# Altium project power_board.PrjPcb (part 1 of 2)
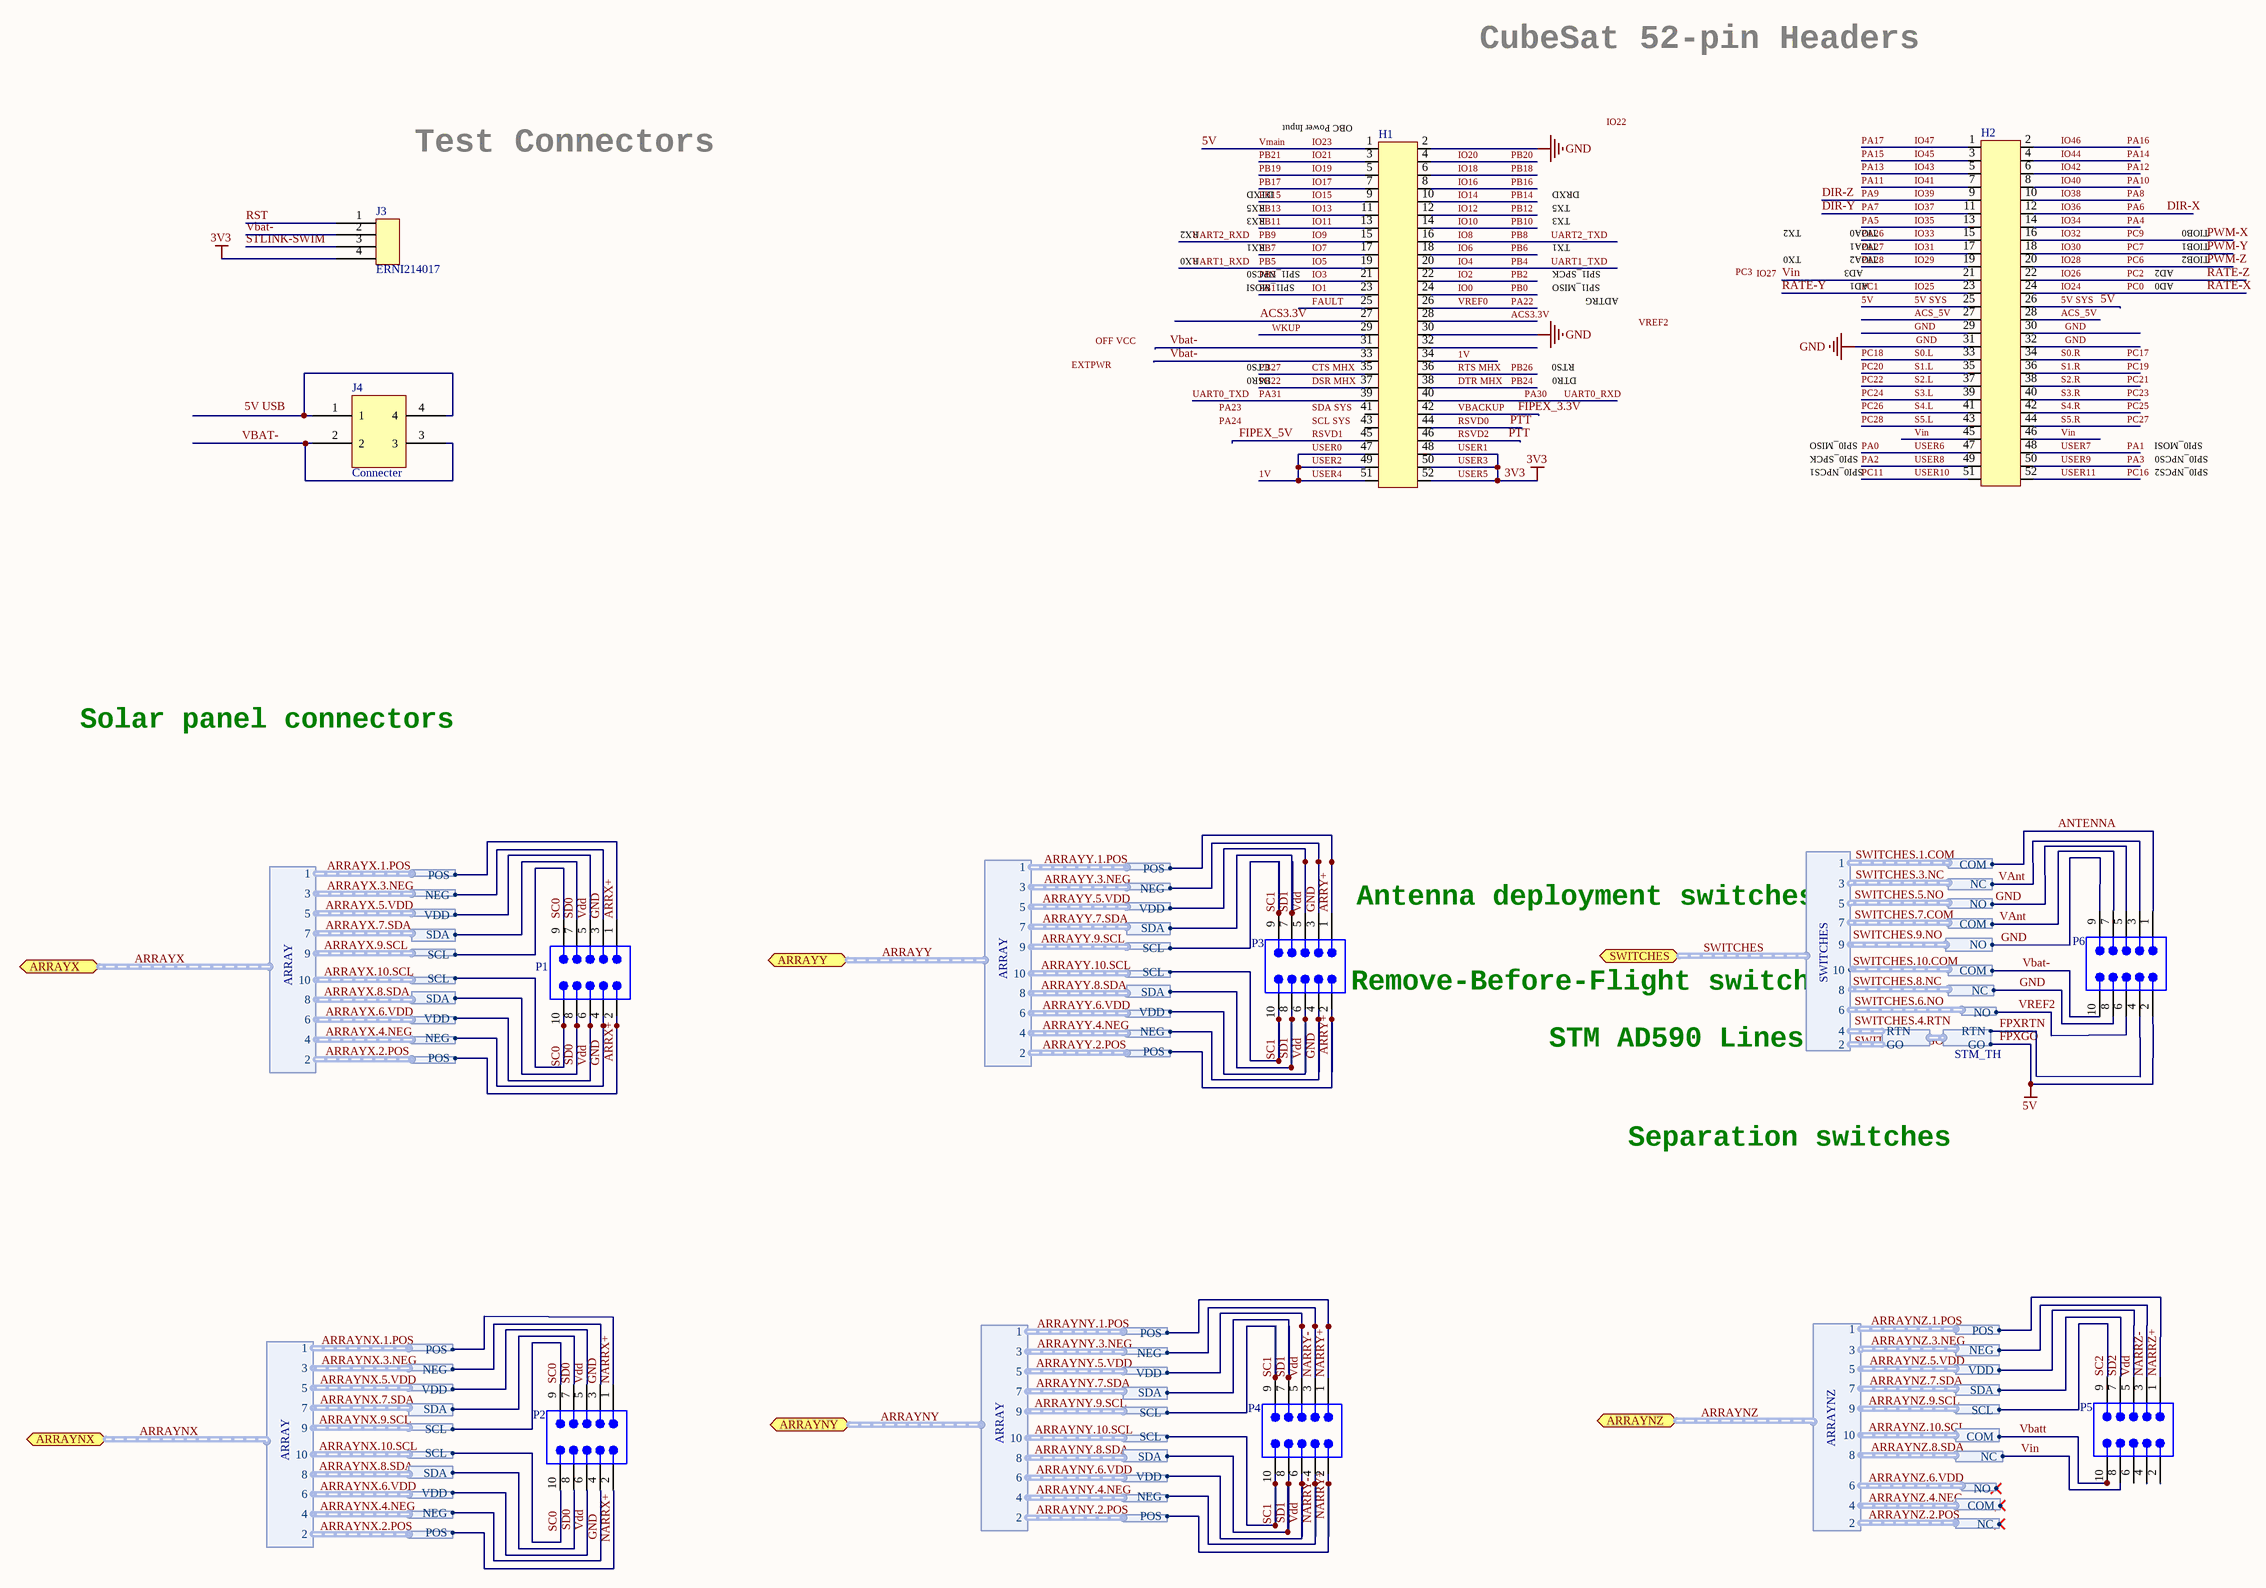
[diagram p0: power_board_2.SchDoc.SchDoc]
5 sheets, 240 parts. Net scope: global (net labels, ports and power ports of the same name join across sheets).
Board file: PCB1_done2.PcbDoc
Sheets:
  power_board_2.SchDoc.SchDoc
  power_board_uC.SchDoc
  MPPT-BCR.SchDoc
  BCR.SchDoc
  MPPT_Measurements.SchDoc

## Sheet power_board_2.SchDoc.SchDoc
size C

### Parts
H1  (no value)  [SAMTEC_ESQ_126_39_G_D]
H2  (no value)  [SAMTEC_ESQ_126_39_G_D]
J3  ERNI214017  [ERNI2014017]
J4  Connecter  [Connecter]
P1  T2M-105-01-L-D-RA  [SMTC-T2M-105-01-X-D-RA]  (value not drawn)
P2  T2M-105-01-L-D-RA  [SMTC-T2M-105-01-X-D-RA]  (value not drawn)
P3  T2M-105-01-L-D-RA  [SMTC-T2M-105-01-X-D-RA]  (value not drawn)
P4  T2M-105-01-L-D-RA  [SMTC-T2M-105-01-X-D-RA]  (value not drawn)
P5  T2M-105-01-L-D-RA  [SMTC-T2M-105-01-X-D-RA]  (value not drawn)
P6  T2M-105-01-L-D-RA  [SMTC-T2M-105-01-X-D-RA]  (value not drawn)

### Ports
ARRAYNX (harness ARRAY), ARRAYNY (harness ARRAY), ARRAYNZ (harness ARRAYNZ), ARRAYX (harness ARRAY), ARRAYY (harness ARRAY), SWITCHES (harness SWITCHES)

### Harnesses
ARRAY: 1, 10, 2, 3, 4, 5, 6, 7, 8, 9
ARRAY+: POS
ARRAY-: NEG
VDD: VDD
SDA: SDA
SCL: SCL
SEPCOM: COM
SEPNC: NC
COM: COM
NC: NC
NO: NO
SWITCHES: 10, 8, 6, 4, 2, 9, 7, 5, 3, 1
STM_TH: RTN, GO
ARRAYNZ: 10, 8, 6, 4, 2, 9, 7, 5, 3, 1

### Nets
3V3: H1.48 H1.50 H1.52 J3.4(RST)  [also labelled USER1, USER3, USER5]
5V: H1.1 H2.25 H2.26 P5.10 P6.2 ; harness SEPCOM.COM, harness STM_TH.GO  [also labelled 5V SYS, FPXGO, IO23, Vbatt, Vmain]
ACS_5V: H2.27 H2.28
ANTENNA: P6.1 ; harness COM.COM
FIPEX_3.3V: H1.42  [also labelled VBACKUP]
FIPEX_5V: H1.45  [also labelled RSVD1]
GND: H1.2 H1.30 H2.29 H2.30 H2.31 H2.32 P1.3 P1.4 P2.3 P2.4 P3.3 P3.4 P6.5 P6.8 P6.9 ; harness ARRAY-.NEG, harness NO.NO, harness SEPNC.NC  [project net ARRAYNX.3.NEG.NEG]
PTT: H1.44 H1.46  [also labelled RSVD0, RSVD2]
1V: H1.34 H1.47 H1.49 H1.51  [also labelled USER0, USER2, USER4]
ACS3.3V: H1.27 H1.28
ARRX+: P1.1 P1.2 ; harness ARRAY+.POS  [project net ARRAYX.1.POS.POS]
ARRY+: P3.1 P3.2 ; harness ARRAY+.POS  [project net ARRAYY.1.POS.POS]
CTS MHX: H1.35  [also labelled PB27]
DIR-X: H2.12  [also labelled IO36, PA6]
DIR-Y: H2.11  [also labelled IO37, PA7]
DIR-Z: H2.9  [also labelled IO39, PA9]
DSR MHX: H1.37  [also labelled PB22]
DTR MHX: H1.38  [also labelled PB24]
FAULT: H1.25
FPXRTN: P6.4 ; harness STM_TH.RTN
IO0: H1.24  [also labelled PB0]
IO1: H1.23  [also labelled PB1]
IO2: H1.22  [also labelled PB2]
IO3: H1.21  [also labelled PB3]
IO4: H1.20  [also labelled PB4, UART1_TXD]
IO5: H1.19  [also labelled PB5, UART1_RXD]
IO6: H1.18  [also labelled PB6]
IO7: H1.17  [also labelled PB7]
IO8: H1.16  [also labelled PB8, UART2_TXD]
IO9: H1.15  [also labelled PB9, UART2_RXD]
IO10: H1.14  [also labelled PB10]
IO11: H1.13  [also labelled PB11]
IO12: H1.12  [also labelled PB12]
IO13: H1.11  [also labelled PB13]
IO14: H1.10  [also labelled PB14]
IO15: H1.9  [also labelled PB15]
IO16: H1.8  [also labelled PB16]
IO17: H1.7  [also labelled PB17]
IO18: H1.6  [also labelled PB18]
IO19: H1.5  [also labelled PB19]
IO20: H1.4  [also labelled PB20]
IO21: H1.3  [also labelled PB21]
IO24: H2.24  [also labelled PC0, RATE-X]
IO25: H2.23  [also labelled PC1, RATE-Y]
IO26: H2.22  [also labelled PC2, RATE-Z]
IO28: H2.20  [also labelled PC6, PWM-Z]
IO29: H2.19  [also labelled PA28]
IO30: H2.18  [also labelled PC7, PWM-Y]
IO31: H2.17  [also labelled PA27]
IO32: H2.16  [also labelled PC9, PWM-X]
IO33: H2.15  [also labelled PA26]
IO34: H2.14  [also labelled PA4]
IO35: H2.13  [also labelled PA5]
IO38: H2.10  [also labelled PA8]
IO40: H2.8  [also labelled PA10]
IO41: H2.7  [also labelled PA11]
IO42: H2.6  [also labelled PA12]
IO43: H2.5  [also labelled PA13]
IO44: H2.4  [also labelled PA14]
IO45: H2.3  [also labelled PA15]
IO46: H2.2  [also labelled PA16]
IO47: H2.1  [also labelled PA17]
NARRX+: P2.1 P2.2 ; harness ARRAY+.POS  [project net ARRAYNX.1.POS.POS]
NARRY+: P4.1 P4.2 ; harness ARRAY+.POS  [project net ARRAYNY.1.POS.POS]
NARRY-: P4.3 P4.4 ; harness ARRAY-.NEG  [project net ARRAYNY.3.NEG.NEG]
NARRZ+: P5.1 ; harness ARRAY+.POS  [project net ARRAYNZ.1.POS.POS]
NARRZ-: P5.3 ; harness ARRAY-.NEG  [project net ARRAYNZ.3.NEG.NEG]
PA0: H2.47  [also labelled USER6]
PA1: H2.48  [also labelled USER7]
PA2: H2.49  [also labelled USER8]
PA3: H2.50  [also labelled USER9]
PA22: H1.26  [also labelled VREF0]
PA30: H1.40  [also labelled UART0_RXD]
PA31: H1.39  [also labelled UART0_TXD]
PB26: H1.36  [also labelled RTS MHX]
PC11: H2.51  [also labelled USER10]
PC16: H2.52  [also labelled USER11]
PC17: H2.34  [also labelled S0.R]
PC18: H2.33  [also labelled S0.L]
PC19: H2.36  [also labelled S1.R]
PC20: H2.35  [also labelled S1.L]
PC21: H2.38  [also labelled S2.R]
PC22: H2.37  [also labelled S2.L]
PC23: H2.40  [also labelled S3.R]
PC24: H2.39  [also labelled S3.L]
PC25: H2.42  [also labelled S4.R]
PC26: H2.41  [also labelled S4.L]
PC27: H2.44  [also labelled S5.R]
PC28: H2.43  [also labelled S5.L]
RST: J3.1(VCC)
SC0: P1.9 P1.10 P2.9 P2.10 ; harness SCL.SCL  [project net ARRAYNX.10.SCL.SCL]
SC1: P3.9 P3.10 P4.9 P4.10 ; harness SCL.SCL  [project net ARRAYNY.10.SCL.SCL]
SC2: P5.9 ; harness SCL.SCL  [project net ARRAYNZ.9.SCL.SCL]
SD0: P1.7 P1.8 P2.7 P2.8 ; harness SDA.SDA  [project net ARRAYNX.7.SDA.SDA]
SD1: P3.7 P3.8 P4.7 P4.8 ; harness SDA.SDA  [project net ARRAYNY.7.SDA.SDA]
SD2: P5.7 ; harness SDA.SDA  [project net ARRAYNZ.7.SDA.SDA]
STLINK-SWIM: J3.3(GND)
VAnt: P6.3 P6.7 ; harness NC.NC, harness COM.COM  [project net SWITCHES.3.NC.NC]
Vbat-: H1.31 H1.33 J3.2(DATA) J4.2 J4.3 P6.10 ; harness SEPCOM.COM  [project net SWITCHES.10.COM.COM]
Vdd: P1.5 P1.6 P2.5 P2.6 P3.5 P3.6 P4.5 P4.6 P5.5 ; harness VDD.VDD  [project net ARRAYNX.5.VDD.VDD]
Vin: H2.21 H2.45 H2.46 P5.8 ; harness SEPNC.NC  [project net ARRAYNZ.8.SDA.NC]
VREF2: P6.6 ; harness NO.NO
WKUP: H1.29
NetJ4_1: J4.1 J4.4

Not connected (* = marked no-connect by the designer): H1 32 41 43; P5 2 4 6

### Buses and harness runs
harness ARRAYNX = port ARRAYNX
harness ARRAYNY = port ARRAYNY
harness ARRAYNZ = port ARRAYNZ
harness ARRAYX = port ARRAYX
harness ARRAYY = port ARRAYY
harness SWITCHES = port SWITCHES

### Notes on the sheet
- CubeSat 52-pin Headers
- Test Connectors
- OBC Power Input
- RX2
- RX3
- RX5
- DTXD
- TX3
- TX5
- DRXD
- TX2
- TIOA0
- TIOB0
- RX0
- RX1
- SPI1_NPCS0
- SPI1_MOSI
- TX1
- SPI1_SPCK
- SPI1_MISO
- ADTRG
- TX0
- AD3
- AD1
- TIOA1
- TIOA2
- AD0
- AD2
- TIOB1
- TIOB2
- CTS0
- RTS0
- DSR0
- DTR0
- SPI0_MISO
- SPI0_SPCK
- SPI0_NPCS1
- SPI0_MOSI
- SPI0_NPCS0
- SPI0_NPCS2
- Solar panel connectors
- (near P3) Antenna deployment switches
- (near P3) Remove-Before-Flight switch
- STM AD590 Lines
- Separation switches
- Labels drawn without touching a wire or pin: 5V USB, EXTPWR, IO22, IO27, OFF VCC, PA23, PA24, PC3, SCL SYS, SDA SYS, SWITCHES.2.GO, SWITCHES.4.RTN, SWITCHES.6.NO, SWITCHES.9.NO, VREF2

### Library data of the parts
H1 H2 = SAMTEC_ESQ_126_39_G_D: 26X2 header
P1-P6 = CMP-1029-00150-1: High Reliability Cable Header, Through-hole, Right Angle, -55 to 125 degC, 2 mm Pitch, 10-Pin, Male, RoHS; Manufacturer: Samtec; Pitch: 2 mm; PackageVersion: V, 3/2009; ComponentLink3Description: Package Specification; ComponentLink2Description: Datasheet; Mounting Technology: Through-hole; DatasheetVersion: F-214; PartNumber: T2M-105-01-L-D-RA; PackageReference: T2M-105-01-X-D-RA; ComponentLink2URL: http://d2a072wq521u33.cloudfront.net/catalog_english//t2m.pdf; ComponentLink3URL: http://www.samtec.com/documents/webfiles/cpdf/T2M-1XX-XX-X-D-XX-XX-MKT.pdf; Temperature Range: -55 to 125 degC; ComponentLink1URL: http://www.samtec.com; RoHS: True; PackageDescription: 2mm Shrouded Terminal Strip; ComponentLink1Description: Manufacturer URL; Orientation: Right Angle; Supplier 1: Newark; Supplier Part Number 1: 79X2144
J3 = ERNI214017: Supplier 1: Mouser; Supplier Part Number 1: 305-214017
J4 = Connecter: Supplier 1: Digi-Key; Supplier Part Number 1: SAM1006-02-ND

## Sheet power_board_uC.SchDoc
size A4
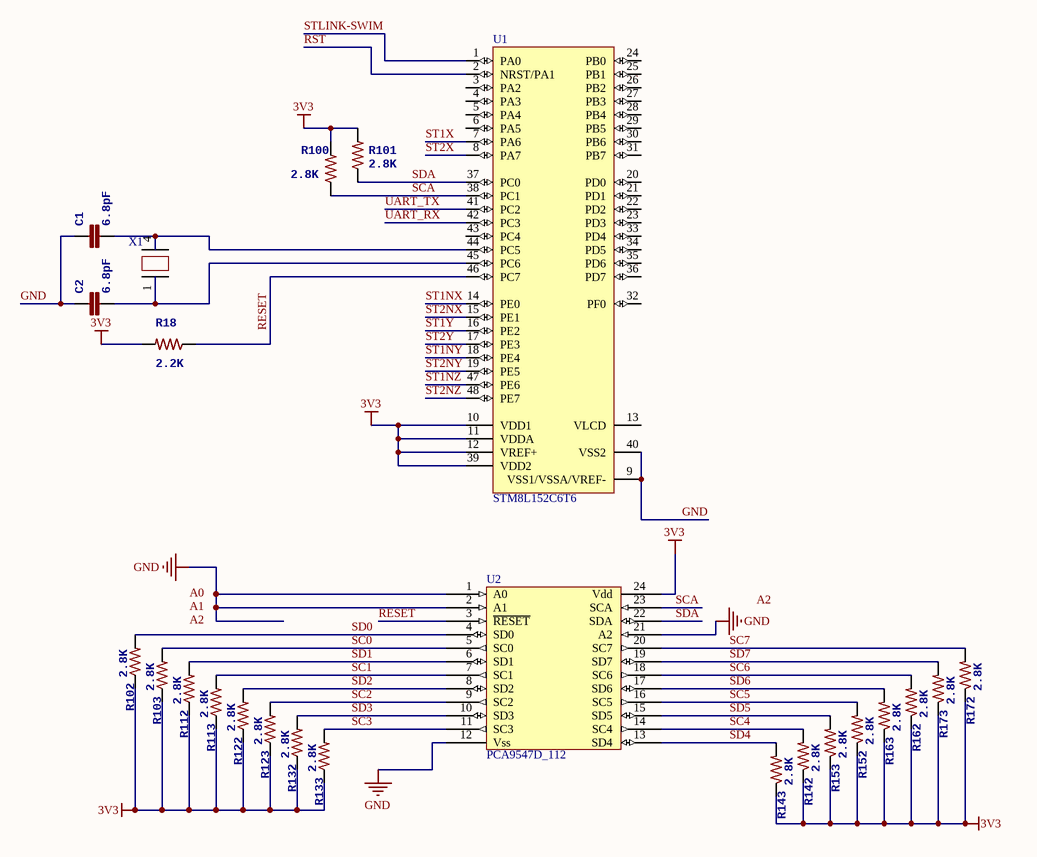
[diagram p1: power_board_uC.SchDoc]

### Parts
C1  6.8pF  [0402-CAP]
C2  6.8pF  [0402-CAP]
R18  2.2K  [0805]
R100  2.8K  [0805]
R101  2.8K  [0805]
R102  2.8K  [0805]
R103  2.8K  [0805]
R112  2.8K  [0805]
R113  2.8K  [0805]
R122  2.8K  [0805]
R123  2.8K  [0805]
R132  2.8K  [0805]
R133  2.8K  [0805]
R142  2.8K  [0805]
R143  2.8K  [0805]
R152  2.8K  [0805]
R153  2.8K  [0805]
R162  2.8K  [0805]
R163  2.8K  [0805]
R172  2.8K  [0805]
R173  2.8K  [0805]
U1  STM8L152C6T6  [LQFP48_M]
U2  PCA9547D_112  [TSOP65P640X110-24N]
X1  XTAL_32MHz  [SOJ550P350X254-4M]  (value not drawn)

### Nets
3V3: R18.2 R100.2 R101.2 R102.1 R103.1 R112.1 R113.1 R122.1 R123.1 R132.1 R133.1 R142.1 R143.1 R152.1 R153.1 R162.1 R163.1 R172.1 R173.1 U1.10(VDD1) U1.11(VDDA) U1.12(VREF+) U1.39(VDD2) U2.24(Vdd)
GND: C1.1 C2.1 U1.9(VSS1/VSSA/VREF-) U1.40(VSS2) U2.1(A0) U2.2(A1) U2.12(Vss) U2.21(A2)  [project net ARRAYNX.3.NEG.NEG]
RESET: R18.1 U1.46(PC7) U2.3(~{RESET})
RST: U1.2(NRST/PA1)
SC0: R103.2 U2.5(SC0)  [project net ARRAYNX.10.SCL.SCL]
SC1: R113.2 U2.7(SC1)  [project net ARRAYNY.10.SCL.SCL]
SC2: R123.2 U2.9(SC2)  [project net ARRAYNZ.9.SCL.SCL]
SC3: R133.2 U2.11(SC3)
SC4: R142.2 U2.14(SC4)
SC5: R152.2 U2.16(SC5)
SC6: R162.2 U2.18(SC6)
SC7: R172.2 U2.20(SC7)
SCA: R100.1 U1.38(PC1) U2.23(SCA)
SD0: R102.2 U2.4(SD0)  [project net ARRAYNX.7.SDA.SDA]
SD1: R112.2 U2.6(SD1)  [project net ARRAYNY.7.SDA.SDA]
SD2: R122.2 U2.8(SD2)  [project net ARRAYNZ.7.SDA.SDA]
SD3: R132.2 U2.10(SD3)
SD4: R143.2 U2.13(SD4)
SD5: R153.2 U2.15(SD5)
SD6: R163.2 U2.17(SD6)
SD7: R173.2 U2.19(SD7)
SDA: R101.1 U1.37(PC0) U2.22(SDA)
ST1NX: U1.14(PE0)
ST1NY: U1.18(PE4)
ST1NZ: U1.47(PE6)
ST1X: U1.7(PA6)
ST1Y: U1.16(PE2)
ST2NX: U1.15(PE1)
ST2NY: U1.19(PE5)
ST2NZ: U1.48(PE7)
ST2X: U1.8(PA7)
ST2Y: U1.17(PE3)
STLINK-SWIM: U1.1(PA0)
UART_RX: U1.42(PC3)
UART_TX: U1.41(PC2)
NetC1_2: C1.2 U1.44(PC5) X1.4
NetC2_2: C2.2 U1.45(PC6) X1.1

Not connected (* = marked no-connect by the designer): U1 3(PA2) 4(PA3) 5(PA4) 6(PA5) 13(VLCD) 20(PD0) 21(PD1) 22(PD2) 23(PD3) 24(PB0) 25(PB1) 26(PB2) 27(PB3) 28(PB4) 29(PB5) 30(PB6) 31(PB7) 32(PF0) 33(PD4) 34(PD5) 35(PD6) 36(PD7) 43(PC4)

### Notes on the sheet
- Labels drawn without touching a wire or pin: A0, A1, A2

### Library data of the parts
C1 C2 = CAP0402-6_8pF: Value: 6.8pF; Supplier 1: Digi-Key; Supplier Part Number 1: 490-5950-1-ND
R18 = RES_0805_2k2: Manufacturer: TE Connectivity; Manufacturer Part Number: 1625856-2; Resistance (Ohms): 100M; Tolerance: ±10%; Power (Watts): 0.125W, 1/8W; Temperature Coefficient: ±100ppm/°C; RoHS: RoHS Compliant; Category: Resistors; Packaging: Cut Tape (CT); Composition: Thick Film; Features: -; Operating Temperature: -55°C ~ 125°C; Package / Case: 0805 (2012 Metric); Supplier Device Package: 0805; Size / Dimension: 0.079" L x 0.047" W (2.00mm x 1.20mm); Height: 0.020" (0.50mm); Number of Terminations: 2; ComponentLink1URL: http://www.te.com/commerce/DocumentDelivery/DDEController?Action=srchrtrv&DocNm=1625856&DocType=Customer+Drawing&DocLang=English; ComponentLink1Description: http://www.te.com/commerce/DocumentDelivery/DDEController?Action=srchrtrv&DocNm=1625856&DocType=Customer+Drawing&DocLang=English; Value: 2.2K; Supplier 1: Digi-Key; Supplier Part Number 1: 311-42.2KCRCT-ND
R100-R103 R112 R113 R122 R123 R132 R133 R142 R143 R152 R153 R162 R163 R172 R173 = RES_0805_2k8: Manufacturer: TE Connectivity; Manufacturer Part Number: 1625856-2; Resistance (Ohms): 100M; Tolerance: ±10%; Power (Watts): 0.125W, 1/8W; Temperature Coefficient: ±100ppm/°C; RoHS: RoHS Compliant; Category: Resistors; Packaging: Cut Tape (CT); Composition: Thick Film; Features: -; Operating Temperature: -55°C ~ 125°C; Package / Case: 0805 (2012 Metric); Supplier Device Package: 0805; Size / Dimension: 0.079" L x 0.047" W (2.00mm x 1.20mm); Height: 0.020" (0.50mm); Number of Terminations: 2; ComponentLink1URL: http://www.te.com/commerce/DocumentDelivery/DDEController?Action=srchrtrv&DocNm=1625856&DocType=Customer+Drawing&DocLang=English; ComponentLink1Description: http://www.te.com/commerce/DocumentDelivery/DDEController?Action=srchrtrv&DocNm=1625856&DocType=Customer+Drawing&DocLang=English; Value: 2.8K; Supplier 1: Digi-Key; Supplier Part Number 1: P2.80KCCT-ND
U1 = CMP-0235-00048-1: STM8L ARM-based EnergyLite 8-bit MCU, LCD, 32 kB Flash, 2 kB Internal RAM, -40 to +85°C Temperature, 48-pin LQFP, Tray; ComponentLink1URL: http://www.st.com/internet/com/TECHNICAL_RESOURCES/TECHNICAL_LITERATURE/DATASHEET/CD00240181.pdf; ComponentLink2Description: STM8L Family Web Page; ComponentLink3URL: http://www.st.com/internet/com/home/home.jsp; ComponentLink1Description: STM8L151/152,x4,x6 Datasheet; PackageVersion: rev13, Apr-2011; PackageDescription: 48-Pin Low-Profile Quad Flat Pack, 7 x 7 mm Body, 0.5 mm Pitch (LQFP48); PackageReference: LQFP48; ComponentLink2URL: http://www.st.com/internet/mcu/subclass/1381.jsp; ComponentLink3Description: st.com Home; Supplier 1: Digi-Key; Supplier Part Number 1: 497-10512-ND
U2 = PCA9547D_112: Supplier 1: Digi-Key; Supplier Part Number 1: 568-11921-1-ND
X1 = XTAL_32MHz: Supplier 1: Digi-Key; Supplier Part Number 1: SER2417CT-ND

## Sheet MPPT-BCR.SchDoc
size C
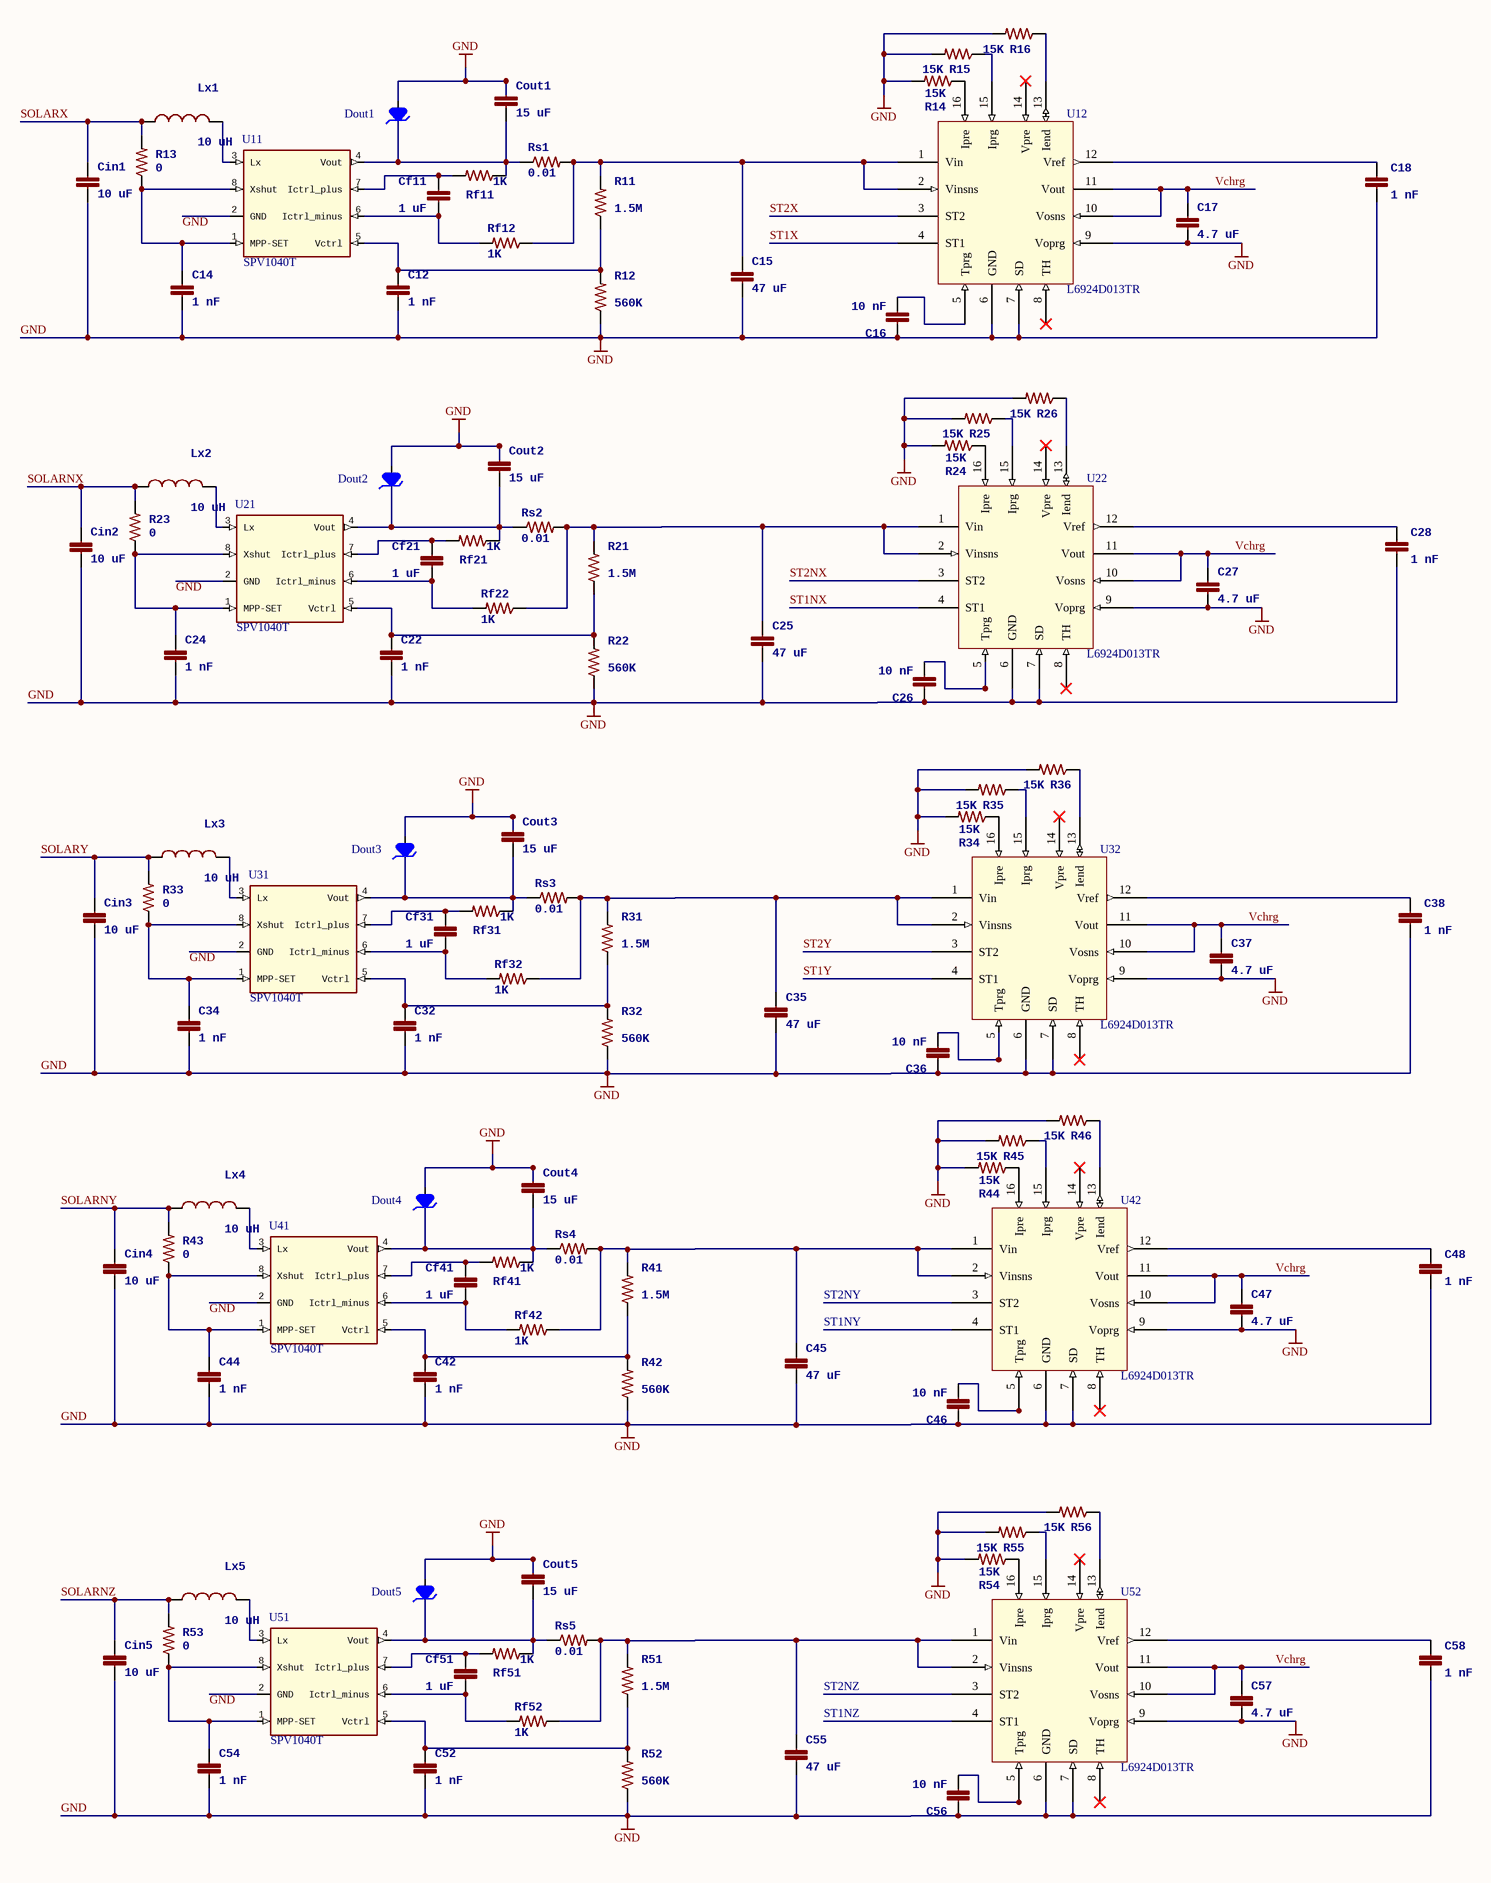
[diagram p2: MPPT-BCR.SchDoc]

### Parts
C12  1 nF  [0805]
C14  1 nF  [0805]
C15  47 uF  [0805]
C16  10 nF  [0805]
C17  4.7 uF  [0805]
C18  1 nF  [0805]
C22  1 nF  [0805]
C24  1 nF  [0805]
C25  47 uF  [0805]
C26  10 nF  [0805]
C27  4.7 uF  [0805]
C28  1 nF  [0805]
C32  1 nF  [0805]
C34  1 nF  [0805]
C35  47 uF  [0805]
C36  10 nF  [0805]
C37  4.7 uF  [0805]
C38  1 nF  [0805]
C42  1 nF  [0805]
C44  1 nF  [0805]
C45  47 uF  [0805]
C46  10 nF  [0805]
C47  4.7 uF  [0805]
C48  1 nF  [0805]
C52  1 nF  [0805]
C54  1 nF  [0805]
C55  47 uF  [0805]
C56  10 nF  [0805]
C57  4.7 uF  [0805]
C58  1 nF  [0805]
Cf11  1 uF  [0805]
Cf21  1 uF  [0805]
Cf31  1 uF  [0805]
Cf41  1 uF  [0805]
Cf51  1 uF  [0805]
Cin1  10 uF  [0805]
Cin2  10 uF  [0805]
Cin3  10 uF  [0805]
Cin4  10 uF  [0805]
Cin5  10 uF  [0805]
Cout1  15 uF  [1210]
Cout2  15 uF  [1210]
Cout3  15 uF  [1210]
Cout4  15 uF  [1210]
Cout5  15 uF  [1210]
Dout1  Diode_Zener  [STmite]  (value not drawn)
Dout2  Diode_Zener  [STmite]  (value not drawn)
Dout3  Diode_Zener  [STmite]  (value not drawn)
Dout4  Diode_Zener  [STmite]  (value not drawn)
Dout5  Diode_Zener  [STmite]  (value not drawn)
Lx1  10 uH  [1007]
Lx2  10 uH  [1007]
Lx3  10 uH  [1007]
Lx4  10 uH  [1007]
Lx5  10 uH  [1007]
R11  1.5M  [0805]
R12  560K  [0805]
R13  0  [0805]
R14  15K  [0805]
R15  15K  [0805]
R16  15K  [0805]
R21  1.5M  [0805]
R22  560K  [0805]
R23  0  [0805]
R24  15K  [0805]
R25  15K  [0805]
R26  15K  [0805]
R31  1.5M  [0805]
R32  560K  [0805]
R33  0  [0805]
R34  15K  [0805]
R35  15K  [0805]
R36  15K  [0805]
R41  1.5M  [0805]
R42  560K  [0805]
R43  0  [0805]
R44  15K  [0805]
R45  15K  [0805]
R46  15K  [0805]
R51  1.5M  [0805]
R52  560K  [0805]
R53  0  [0805]
R54  15K  [0805]
R55  15K  [0805]
R56  15K  [0805]
Rf11  1K  [0805]
Rf12  1K  [0805]
Rf21  1K  [0805]
Rf22  1K  [0805]
Rf31  1K  [0805]
Rf32  1K  [0805]
Rf41  1K  [0805]
Rf42  1K  [0805]
Rf51  1K  [0805]
Rf52  1K  [0805]
Rs1  0.01  [0805]
Rs2  0.01  [0805]
Rs3  0.01  [0805]
Rs4  0.01  [0805]
Rs5  0.01  [0805]
U11  Manufacturer Part Number: SPV1040T  [TSSOP8]  (hidden comment: SPV1040)
U12  L6924D013TR  [VQFN16_AP]
U21  Manufacturer Part Number: SPV1040T  [TSSOP8]  (hidden comment: SPV1040)
U22  L6924D013TR  [VQFN16_AP]
U31  Manufacturer Part Number: SPV1040T  [TSSOP8]  (hidden comment: SPV1040)
U32  L6924D013TR  [VQFN16_AP]
U41  Manufacturer Part Number: SPV1040T  [TSSOP8]  (hidden comment: SPV1040)
U42  L6924D013TR  [VQFN16_AP]
U51  Manufacturer Part Number: SPV1040T  [TSSOP8]  (hidden comment: SPV1040)
U52  L6924D013TR  [VQFN16_AP]

### Nets
GND: C12.2 C14.2 C15.2 C16.1 C17.2 C18.2 C22.2 C24.2 C25.2 C26.1 C27.2 C28.2 C32.2 C34.2 C35.2 C36.1 C37.2 C38.2 C42.2 C44.2 C45.2 C46.1 C47.2 C48.2 C52.2 C54.2 C55.2 C56.1 C57.2 C58.2 Cin1.2 Cin2.2 Cin3.2 Cin4.2 Cin5.2 Cout1.1 Cout2.1 Cout3.1 Cout4.1 Cout5.1 Dout1.2 Dout2.2 Dout3.2 Dout4.2 Dout5.2 R12.1 R14.2 R15.2 R16.2 R22.1 R24.2 R25.2 R26.2 R32.1 R34.2 R35.2 R36.2 R42.1 R44.2 R45.2 R46.2 R52.1 R54.2 R55.2 R56.2 U12.6(GND) U12.7(SD) U12.9(Voprg) U22.6(GND) U22.7(SD) U22.9(Voprg) U32.6(GND) U32.7(SD) U32.9(Voprg) U42.6(GND) U42.7(SD) U42.9(Voprg) U52.6(GND) U52.7(SD) U52.9(Voprg)  [project net ARRAYNX.3.NEG.NEG]
SOLARNX: Cin2.1 Lx2.1 R23.2
SOLARNY: Cin4.1 Lx4.1 R43.2
SOLARNZ: Cin5.1 Lx5.1 R53.2
SOLARX: Cin1.1 Lx1.1 R13.2
SOLARY: Cin3.1 Lx3.1 R33.2
ST1NX: U22.4(ST1)
ST1X: U12.4(ST1)
ST1Y: U32.4(ST1)
ST2NX: U22.3(ST2)
ST2X: U12.3(ST2)
ST2Y: U32.3(ST2)
Vchrg: C17.1 C27.1 C37.1 C47.1 C57.1 U12.10(Vosns) U12.11(Vout) U22.10(Vosns) U22.11(Vout) U32.10(Vosns) U32.11(Vout) U42.10(Vosns) U42.11(Vout) U52.10(Vosns) U52.11(Vout)
NetC12_1: C12.1 R11.1 R12.2 U11.5(Vctrl)
NetC14_1: C14.1 R13.1 U11.1(MPP-SET) U11.8(Xshut)
NetC15_1: C15.1 R11.2 Rf12.1 Rs1.2 U12.1(Vin) U12.2(Vinsns)
NetC16_2: C16.2 U12.5(Tprg)
NetC18_1: C18.1 U12.12(Vref)
NetC22_1: C22.1 R21.1 R22.2 U21.5(Vctrl)
NetC24_1: C24.1 R23.1 U21.1(MPP-SET) U21.8(Xshut)
NetC25_1: C25.1 R21.2 Rf22.1 Rs2.2 U22.1(Vin) U22.2(Vinsns)
NetC26_2: C26.2 U22.5(Tprg)
NetC28_1: C28.1 U22.12(Vref)
NetC32_1: C32.1 R31.1 R32.2 U31.5(Vctrl)
NetC34_1: C34.1 R33.1 U31.1(MPP-SET) U31.8(Xshut)
NetC35_1: C35.1 R31.2 Rf32.1 Rs3.2 U32.1(Vin) U32.2(Vinsns)
NetC36_2: C36.2 U32.5(Tprg)
NetC38_1: C38.1 U32.12(Vref)
NetC42_1: C42.1 R41.1 R42.2 U41.5(Vctrl)
NetC44_1: C44.1 R43.1 U41.1(MPP-SET) U41.8(Xshut)
NetC45_1: C45.1 R41.2 Rf42.1 Rs4.2 U42.1(Vin) U42.2(Vinsns)
NetC46_2: C46.2 U42.5(Tprg)
NetC48_1: C48.1 U42.12(Vref)
NetC52_1: C52.1 R51.1 R52.2 U51.5(Vctrl)
NetC54_1: C54.1 R53.1 U51.1(MPP-SET) U51.8(Xshut)
NetC55_1: C55.1 R51.2 Rf52.1 Rs5.2 U52.1(Vin) U52.2(Vinsns)
NetC56_2: C56.2 U52.5(Tprg)
NetC58_1: C58.1 U52.12(Vref)
NetCf11_1: Cf11.1 Rf11.2 U11.7(Ictrl_plus)
NetCf11_2: Cf11.2 Rf12.2 U11.6(Ictrl_minus)
NetCf21_1: Cf21.1 Rf21.2 U21.7(Ictrl_plus)
NetCf21_2: Cf21.2 Rf22.2 U21.6(Ictrl_minus)
NetCf31_1: Cf31.1 Rf31.2 U31.7(Ictrl_plus)
NetCf31_2: Cf31.2 Rf32.2 U31.6(Ictrl_minus)
NetCf41_1: Cf41.1 Rf41.2 U41.7(Ictrl_plus)
NetCf41_2: Cf41.2 Rf42.2 U41.6(Ictrl_minus)
NetCf51_1: Cf51.1 Rf51.2 U51.7(Ictrl_plus)
NetCf51_2: Cf51.2 Rf52.2 U51.6(Ictrl_minus)
NetCout1_2: Cout1.2 Dout1.1 Rf11.1 Rs1.1 U11.4(Vout)
NetCout2_2: Cout2.2 Dout2.1 Rf21.1 Rs2.1 U21.4(Vout)
NetCout3_2: Cout3.2 Dout3.1 Rf31.1 Rs3.1 U31.4(Vout)
NetCout4_2: Cout4.2 Dout4.1 Rf41.1 Rs4.1 U41.4(Vout)
NetCout5_2: Cout5.2 Dout5.1 Rf51.1 Rs5.1 U51.4(Vout)
NetLx1_2: Lx1.2 U11.3(Lx)
NetLx2_2: Lx2.2 U21.3(Lx)
NetLx3_2: Lx3.2 U31.3(Lx)
NetLx4_2: Lx4.2 U41.3(Lx)
NetLx5_2: Lx5.2 U51.3(Lx)
NetR14_1: R14.1 U12.16(Ipre)
NetR15_1: R15.1 U12.15(Iprg)
NetR16_1: R16.1 U12.13(Iend)
NetR24_1: R24.1 U22.16(Ipre)
NetR25_1: R25.1 U22.15(Iprg)
NetR26_1: R26.1 U22.13(Iend)
NetR34_1: R34.1 U32.16(Ipre)
NetR35_1: R35.1 U32.15(Iprg)
NetR36_1: R36.1 U32.13(Iend)
NetR44_1: R44.1 U42.16(Ipre)
NetR45_1: R45.1 U42.15(Iprg)
NetR46_1: R46.1 U42.13(Iend)
NetR54_1: R54.1 U52.16(Ipre)
NetR55_1: R55.1 U52.15(Iprg)
NetR56_1: R56.1 U52.13(Iend)

Not connected (* = marked no-connect by the designer): U11 2(GND); U12 8(TH)* 14(Vpre)*; U21 2(GND); U22 8(TH)* 14(Vpre)*; U31 2(GND); U32 8(TH)* 14(Vpre)*; U41 2(GND); U42 3(ST2) 4(ST1) 8(TH)* 14(Vpre)*; U51 2(GND); U52 3(ST2) 4(ST1) 8(TH)* 14(Vpre)*

### Notes on the sheet
- ST2NY
- (near C45) ST1NY
- ST2NZ
- (near C55) ST1NZ
- Labels drawn without touching a wire or pin: GND

### Library data of the parts
C12 C14 C18 C22 C24 C28 C32 C34 C38 C42 C44 C48 C52 C54 C58 = CAP0805_1nF: Tolerance: ±10%; Voltage - Rated: 10V; Temperature Coefficient: X7R; RoHS: RoHS Compliant; Category: Capacitors; Packaging: Tape & Reel (TR); Mounting Type: Surface Mount, MLCC; Operating Temperature: -55°C ~ 125°C; Applications: General Purpose; Ratings: -; Package / Case: 0805 (2012 Metric); Size / Dimension: 0.079" L x 0.049" W (2.00mm x 1.25mm); Height - Seated (Max): -; Thickness (Max): 0.039" (1.00mm); Lead Spacing: -; Features: -; Lead Style: -; ComponentLink1URL: http://www.kemet.com/docfinder?Partnumber=C0805C105K8RACTU; ComponentLink1Description: http://www.kemet.com/docfinder?Partnumber=C0805C105K8RACTU; Value: 1 nF; Supplier 1: Digi-Key; Supplier Part Number 1: 445-1330-1-ND
C15 C25 C35 C45 C55 = CAP0805_47000nF: Tolerance: ±10%; Voltage - Rated: 10V; Temperature Coefficient: X5R; RoHS: RoHS Compliant; Category: Capacitors; Packaging: Tape & Reel (TR); Mounting Type: Surface Mount, MLCC; Operating Temperature: -55°C ~ 125°C; Applications: General Purpose; Ratings: -; Package / Case: 0805 (2012 Metric); Size / Dimension: 0.079" L x 0.049" W (2.00mm x 1.25mm); Thickness (Max): 0.039" (1.00mm); Value: 47 uF; Supplier 1: Digi-Key; Supplier Part Number 1: 399-5506-1-ND
C16 C26 C36 C46 C56 = CAP0805_10nF: Tolerance: ±10%; Voltage - Rated: 10V; Temperature Coefficient: X7R; RoHS: RoHS Compliant; Category: Capacitors; Packaging: Tape & Reel (TR); Mounting Type: Surface Mount, MLCC; Operating Temperature: -55°C ~ 125°C; Applications: General Purpose; Ratings: -; Package / Case: 0805 (2012 Metric); Size / Dimension: 0.079" L x 0.049" W (2.00mm x 1.25mm); Height - Seated (Max): -; Thickness (Max): 0.039" (1.00mm); Lead Spacing: -; Features: -; Lead Style: -; ComponentLink1URL: http://www.kemet.com/docfinder?Partnumber=C0805C105K8RACTU; ComponentLink1Description: http://www.kemet.com/docfinder?Partnumber=C0805C105K8RACTU; Value: 10 nF; Supplier 1: Digi-Key; Supplier Part Number 1: 1276-2437-1-ND
C17 C27 C37 C47 C57 = CAP0805_4700nF: Tolerance: ±10%; Voltage - Rated: 10V; Temperature Coefficient: X5R; RoHS: RoHS Compliant; Category: Capacitors; Packaging: Tape & Reel (TR); Mounting Type: Surface Mount, MLCC; Operating Temperature: -55°C ~ 125°C; Applications: General Purpose; Ratings: -; Package / Case: 0805 (2012 Metric); Size / Dimension: 0.079" L x 0.049" W (2.00mm x 1.25mm); Thickness (Max): 0.039" (1.00mm); Value: 4.7 uF; Supplier 1: Digi-Key; Supplier Part Number 1: 709-1230-1-ND
Cf11 Cf21 Cf31 Cf41 Cf51 = CAP0805_1uF: Manufacturer: Kemet; Manufacturer Part Number: C0805C105K8RACTU; Tolerance: ±10%; Voltage - Rated: 10V; Temperature Coefficient: X7R; RoHS: RoHS Compliant; Category: Capacitors; Packaging: Tape & Reel (TR); Mounting Type: Surface Mount, MLCC; Operating Temperature: -55°C ~ 125°C; Applications: General Purpose; Ratings: -; Package / Case: 0805 (2012 Metric); Size / Dimension: 0.079" L x 0.049" W (2.00mm x 1.25mm); Height - Seated (Max): -; Thickness (Max): 0.039" (1.00mm); Lead Spacing: -; Features: -; Lead Style: -; ComponentLink1URL: http://www.kemet.com/docfinder?Partnumber=C0805C105K8RACTU; ComponentLink1Description: http://www.kemet.com/docfinder?Partnumber=C0805C105K8RACTU; Value: 1 uF; Supplier 1: Digi-Key; Supplier Part Number 1: 445-1358-1-ND
Cin1-Cin5 = CAP0805_10uF: Tolerance: ±10%; Voltage - Rated: 10V; Temperature Coefficient: X5R; RoHS: RoHS Compliant; Category: Capacitors; Packaging: Tape & Reel (TR); Mounting Type: Surface Mount, MLCC; Operating Temperature: -55°C ~ 125°C; Applications: General Purpose; Ratings: -; Package / Case: 0805 (2012 Metric); Size / Dimension: 0.079" L x 0.049" W (2.00mm x 1.25mm); Thickness (Max): 0.039" (1.00mm); Supplier 1: Digi-Key; Supplier Part Number 1: 445-7660-1-ND; Value: 10 uF
Cout1-Cout5 = CAP0805_15uF: Tolerance: ±10%; Voltage - Rated: 10V; Temperature Coefficient: X5R; RoHS: RoHS Compliant; Category: Capacitors; Packaging: Tape & Reel (TR); Mounting Type: Surface Mount, MLCC; Operating Temperature: -55°C ~ 125°C; Applications: General Purpose; Ratings: -; Package / Case: 0805 (2012 Metric); Size / Dimension: 0.079" L x 0.049" W (2.00mm x 1.25mm); Thickness (Max): 0.039" (1.00mm); Value: 15 uF; Supplier 1: Digi-Key; Supplier Part Number 1: 445-3950-2-ND
Dout1-Dout5 = Diode_Zener: Voltage - Zener (Nom) (Vz): 3.3V; Tolerance: ±5%; Power - Max: 3W; Impedance (Max) (Zzt): 10 Ohm; Current - Reverse Leakage @ Vr: 100µA @ 1V; Voltage - Forward (Vf) (Max) @ If: 1.5V @ 200mA; Supplier 1: Digi-Key; RoHS: RoHS Compliant; Category: Discrete Semiconductor Products; Packaging: Cut Tape (CT); Operating Temperature: -65°C ~ 150°C; Mounting Type: Surface Mount; Package / Case: DO-220AA; Supplier Device Package: SMB; ComponentLink1URL: http://www.onsemi.com/pub_link/Collateral/1SMB5913BT3-D.PDF; ComponentLink1Description: http://www.onsemi.com/pub_link/Collateral/1SMB5913BT3-D.PDF; Supplier Part Number 1: 497-15660-1-ND
Lx1-Lx5 = INDUCTOR1007: Supplier 1: Digi-Key; Supplier Part Number 1: 587-1613-1-ND
R11 R21 R31 R41 R51 = RES_0805_1500K: Manufacturer: TE Connectivity; Manufacturer Part Number: 1625856-2; Tolerance: ±10%; Power (Watts): 0.125W, 1/8W; Temperature Coefficient: ±100ppm/°C; Supplier 1: Digi-Key; RoHS: RoHS Compliant; Category: Resistors; Packaging: Cut Tape (CT); Resistance (Ohms): 1.5M; Composition: Thick Film; Features: -; Operating Temperature: -55°C ~ 125°C; Package / Case: 0805 (2012 Metric); Supplier Device Package: 0805; Size / Dimension: 0.079" L x 0.047" W (2.00mm x 1.20mm); Height: 0.020" (0.50mm); Number of Terminations: 2; ComponentLink1URL: http://www.te.com/commerce/DocumentDelivery/DDEController?Action=srchrtrv&DocNm=1625856&DocType=Customer+Drawing&DocLang=English; ComponentLink1Description: http://www.te.com/commerce/DocumentDelivery/DDEController?Action=srchrtrv&DocNm=1625856&DocType=Customer+Drawing&DocLang=English; Supplier Part Number 1: A103799CT-ND; Value: 1.5M
R12 R22 R32 R42 R52 = RES_0805_560K: Manufacturer: TE Connectivity; Manufacturer Part Number: 1625856-2; Tolerance: ±10%; Power (Watts): 0.125W, 1/8W; Temperature Coefficient: ±100ppm/°C; Supplier 1: Digi-Key; RoHS: RoHS Compliant; Category: Resistors; Packaging: Cut Tape (CT); Resistance (Ohms): 560K; Composition: Thick Film; Features: -; Operating Temperature: -55°C ~ 125°C; Package / Case: 0805 (2012 Metric); Supplier Device Package: 0805; Size / Dimension: 0.079" L x 0.047" W (2.00mm x 1.20mm); Height: 0.020" (0.50mm); Number of Terminations: 2; ComponentLink1URL: http://www.te.com/commerce/DocumentDelivery/DDEController?Action=srchrtrv&DocNm=1625856&DocType=Customer+Drawing&DocLang=English; ComponentLink1Description: http://www.te.com/commerce/DocumentDelivery/DDEController?Action=srchrtrv&DocNm=1625856&DocType=Customer+Drawing&DocLang=English; Supplier Part Number 1: A103220CT-ND; Value: 560K
R13 R23 R33 R43 R53 = RES_0805_0: Manufacturer: TE Connectivity; Manufacturer Part Number: 1625856-2; Resistance (Ohms): 100M; Tolerance: ±10%; Power (Watts): 0.125W, 1/8W; Temperature Coefficient: ±100ppm/°C; Supplier 1: Digi-Key; RoHS: RoHS Compliant; Category: Resistors; Packaging: Cut Tape (CT); Composition: Thick Film; Features: -; Operating Temperature: -55°C ~ 125°C; Package / Case: 0805 (2012 Metric); Supplier Device Package: 0805; Size / Dimension: 0.079" L x 0.047" W (2.00mm x 1.20mm); Height: 0.020" (0.50mm); Number of Terminations: 2; ComponentLink1URL: http://www.te.com/commerce/DocumentDelivery/DDEController?Action=srchrtrv&DocNm=1625856&DocType=Customer+Drawing&DocLang=English; ComponentLink1Description: http://www.te.com/commerce/DocumentDelivery/DDEController?Action=srchrtrv&DocNm=1625856&DocType=Customer+Drawing&DocLang=English; Supplier Part Number 1: RHM0.0ARCT-ND; Value: 0
R14-R16 R24-R26 R34-R36 R44-R46 R54-R56 = RES_0805_15K: Manufacturer: TE Connectivity; Manufacturer Part Number: 1625856-2; Tolerance: ±10%; Power (Watts): 0.125W, 1/8W; Temperature Coefficient: ±100ppm/°C; RoHS: RoHS Compliant; Category: Resistors; Packaging: Cut Tape (CT); Resistance (Ohms): 15K; Composition: Thick Film; Features: -; Operating Temperature: -55°C ~ 125°C; Package / Case: 0805 (2012 Metric); Supplier Device Package: 0805; Size / Dimension: 0.079" L x 0.047" W (2.00mm x 1.20mm); Height: 0.020" (0.50mm); Number of Terminations: 2; ComponentLink1URL: http://www.te.com/commerce/DocumentDelivery/DDEController?Action=srchrtrv&DocNm=1625856&DocType=Customer+Drawing&DocLang=English; ComponentLink1Description: http://www.te.com/commerce/DocumentDelivery/DDEController?Action=srchrtrv&DocNm=1625856&DocType=Customer+Drawing&DocLang=English; Value: 15K; Supplier 1: Digi-Key; Supplier Part Number 1: 311-15.0KCRCT-ND
Rf11 Rf12 Rf21 Rf22 Rf31 Rf32 Rf41 Rf42 Rf51 Rf52 = RES_0805_1K: Manufacturer: TE Connectivity; Manufacturer Part Number: 1625856-2; Resistance (Ohms): 100M; Tolerance: ±10%; Power (Watts): 0.125W, 1/8W; Temperature Coefficient: ±100ppm/°C; Supplier 1: Digi-Key; RoHS: RoHS Compliant; Category: Resistors; Packaging: Cut Tape (CT); Composition: Thick Film; Features: -; Operating Temperature: -55°C ~ 125°C; Package / Case: 0805 (2012 Metric); Supplier Device Package: 0805; Size / Dimension: 0.079" L x 0.047" W (2.00mm x 1.20mm); Height: 0.020" (0.50mm); Number of Terminations: 2; ComponentLink1URL: http://www.te.com/commerce/DocumentDelivery/DDEController?Action=srchrtrv&DocNm=1625856&DocType=Customer+Drawing&DocLang=English; ComponentLink1Description: http://www.te.com/commerce/DocumentDelivery/DDEController?Action=srchrtrv&DocNm=1625856&DocType=Customer+Drawing&DocLang=English; Supplier Part Number 1: P1.00KCCT-ND; Value: 1K
Rs1-Rs5 = RES_0805_01: Manufacturer: TE Connectivity; Manufacturer Part Number: 1625856-2; Resistance (Ohms): 100M; Tolerance: ±10%; Power (Watts): 0.125W, 1/8W; Temperature Coefficient: ±100ppm/°C; Supplier 1: Digi-Key; RoHS: RoHS Compliant; Category: Resistors; Packaging: Cut Tape (CT); Composition: Thick Film; Features: -; Operating Temperature: -55°C ~ 125°C; Package / Case: 0805 (2012 Metric); Supplier Device Package: 0805; Size / Dimension: 0.079" L x 0.047" W (2.00mm x 1.20mm); Height: 0.020" (0.50mm); Number of Terminations: 2; ComponentLink1URL: http://www.te.com/commerce/DocumentDelivery/DDEController?Action=srchrtrv&DocNm=1625856&DocType=Customer+Drawing&DocLang=English; ComponentLink1Description: http://www.te.com/commerce/DocumentDelivery/DDEController?Action=srchrtrv&DocNm=1625856&DocType=Customer+Drawing&DocLang=English; Supplier Part Number 1: RL12T.010JCT-ND; Value: 0.01
U11 U21 U31 U41 U51 = SPV1040: Manufacturer: STMicroelectronics; Function: Charge Management, Solar; Voltage - Supply: 0.3 V ~ 5.5 V; Supplier 1: Digi-Key; RoHS: RoHS Compliant; Category: Integrated Circuits (ICs); Stock 1: 10; Pricing 1: 1=5.14, 10=4.584 (CAD); Packaging: Tube; Battery Chemistry: -; Operating Temperature: -40°C ~ 85°C; Mounting Type: Surface Mount; Package / Case: 8-TSSOP (0.173", 4.40mm Width); Supplier Device Package: 8-TSSOP; ComponentLink1URL: http://www.st.com/web/en/resource/technical/document/datasheet/CD00287506.pdf; ComponentLink1Description: http://www.st.com/web/en/resource/technical/document/datasheet/CD00287506.pdf; Supplier Part Number 1: 497-11417-ND
U12 U22 U32 U42 U52 = L6924D013TR: IC BATT CHRGR ION/POLY 16-VFQFPN; Manufacturer: STMicroelectronics; Function: Charge Management; Battery Chemistry: Li-Ion, Li-Pol; Voltage - Supply: 2.5 V ~ 12 V; Supplier 1: Digi-Key; Manufacturer Part Number: L6924D013TR; RoHS: RoHS Compliant; Category: Integrated Circuits (ICs); Stock 1: 3342; Pricing 1: 1=2.74, 10=2.477, 25=2.2188, 100=1.9951, 250=1.77148, 500=1.54788, 1000=1.2813 (CAD); Packaging: Cut Tape (CT); Operating Temperature: -40°C ~ 125°C; Mounting Type: Surface Mount; Package / Case: 16-VFQFN; Supplier Device Package: 16-VFQFP-N (3x3); ComponentLink1URL: http://www.st.com/web/en/resource/technical/document/datasheet/CD00079821.pdf; ComponentLink1Description: http://www.st.com/web/en/resource/technical/document/datasheet/CD00079821.pdf; Supplier Part Number 1: 497-5100-1-ND

## Sheet BCR.SchDoc
size A2; Author: H. Chesser; DrawnBy: H. Chesser
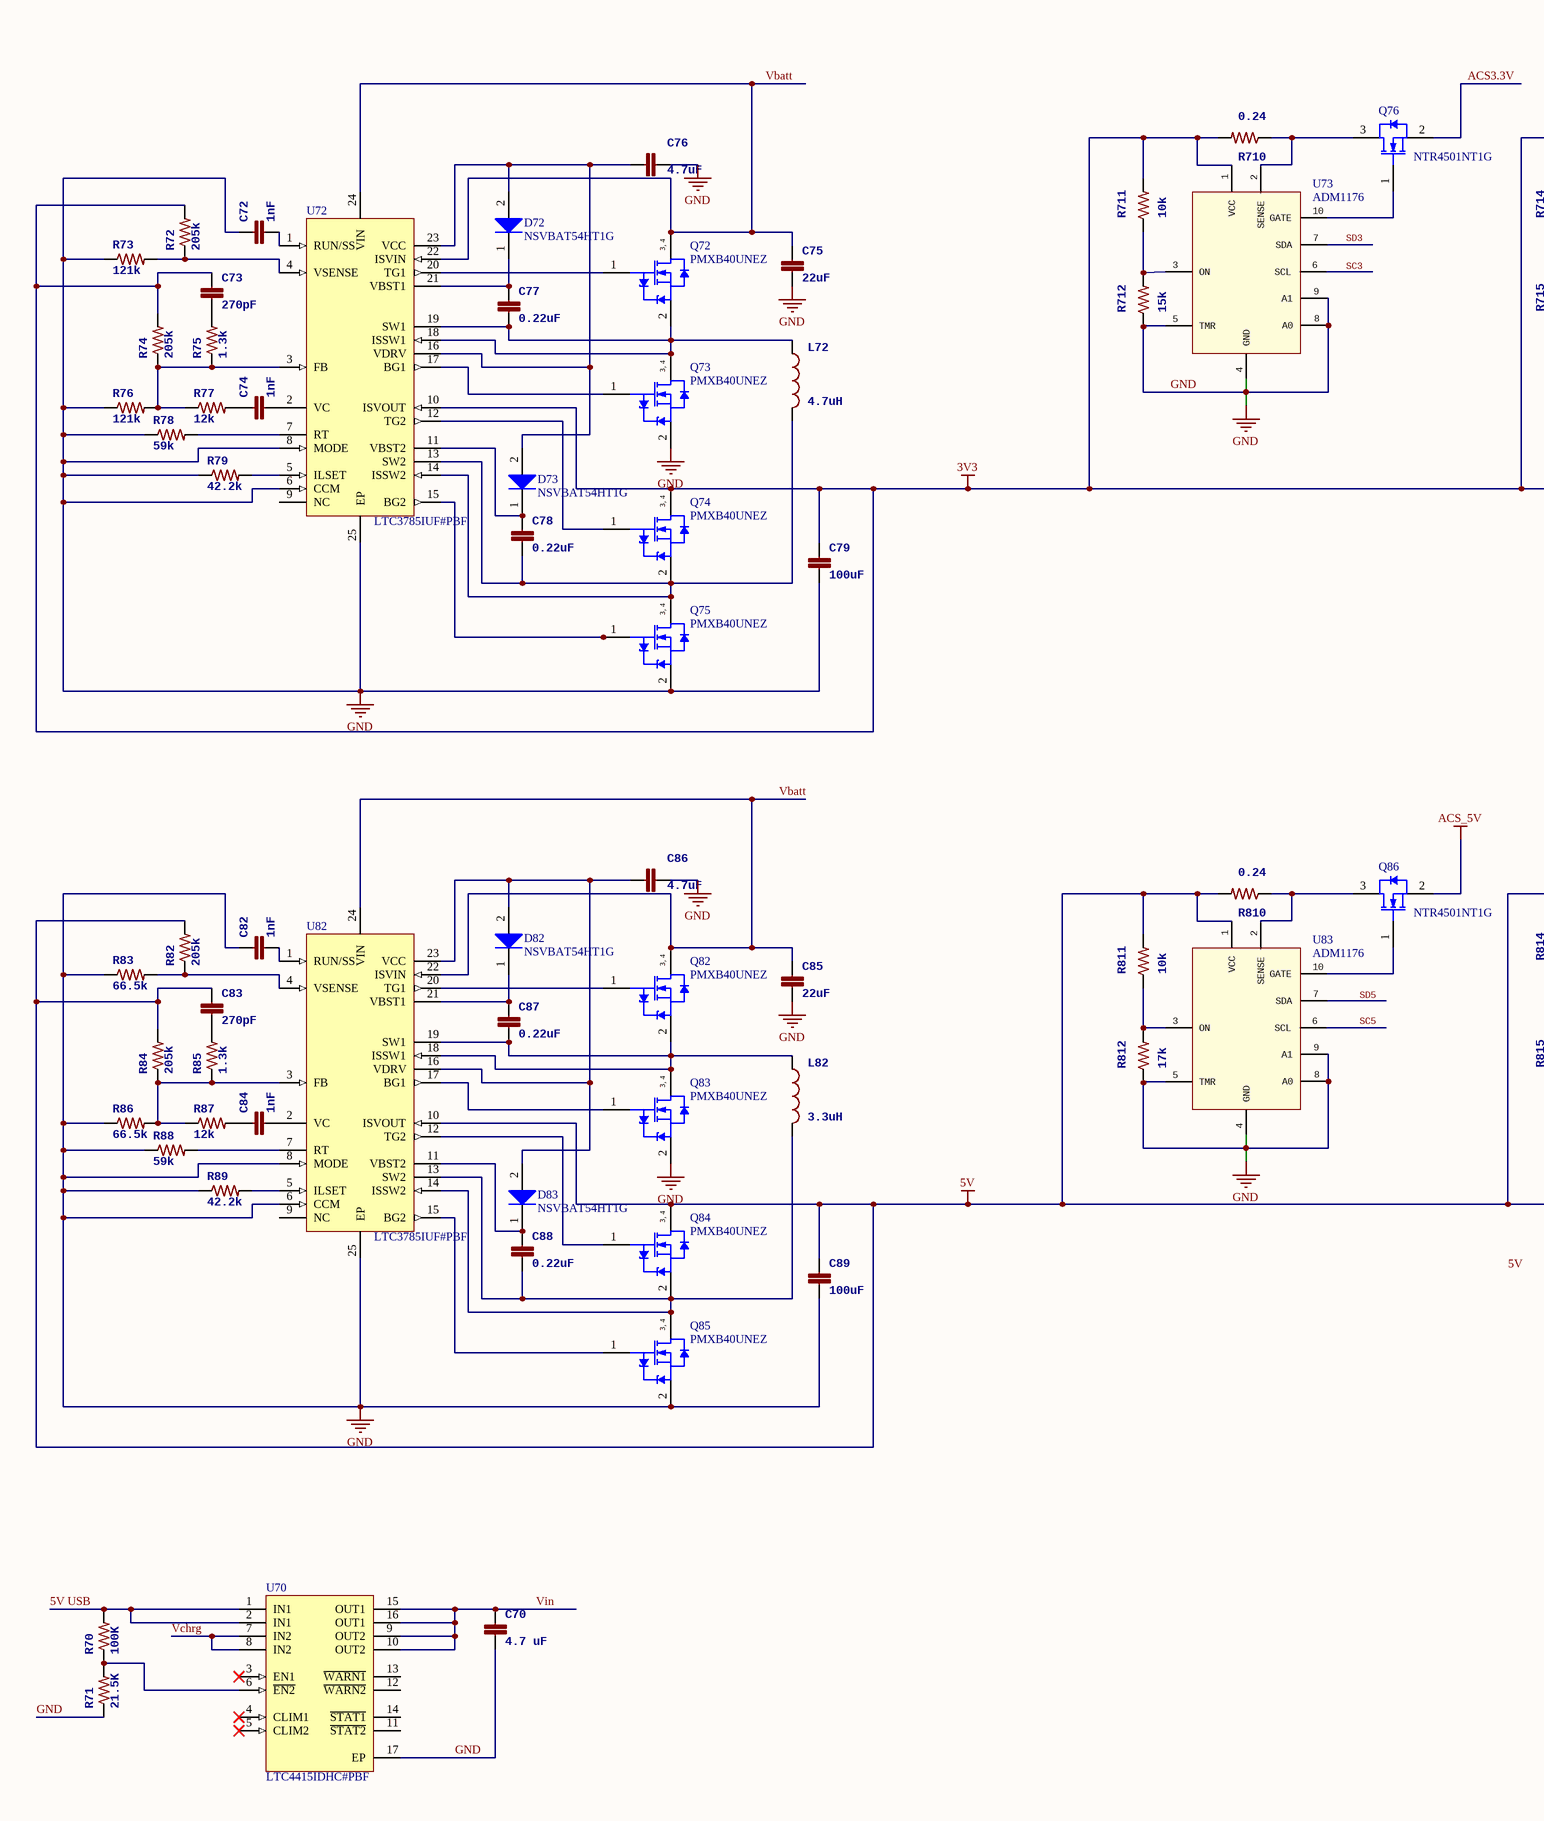
[diagram p3: BCR.SchDoc, left]
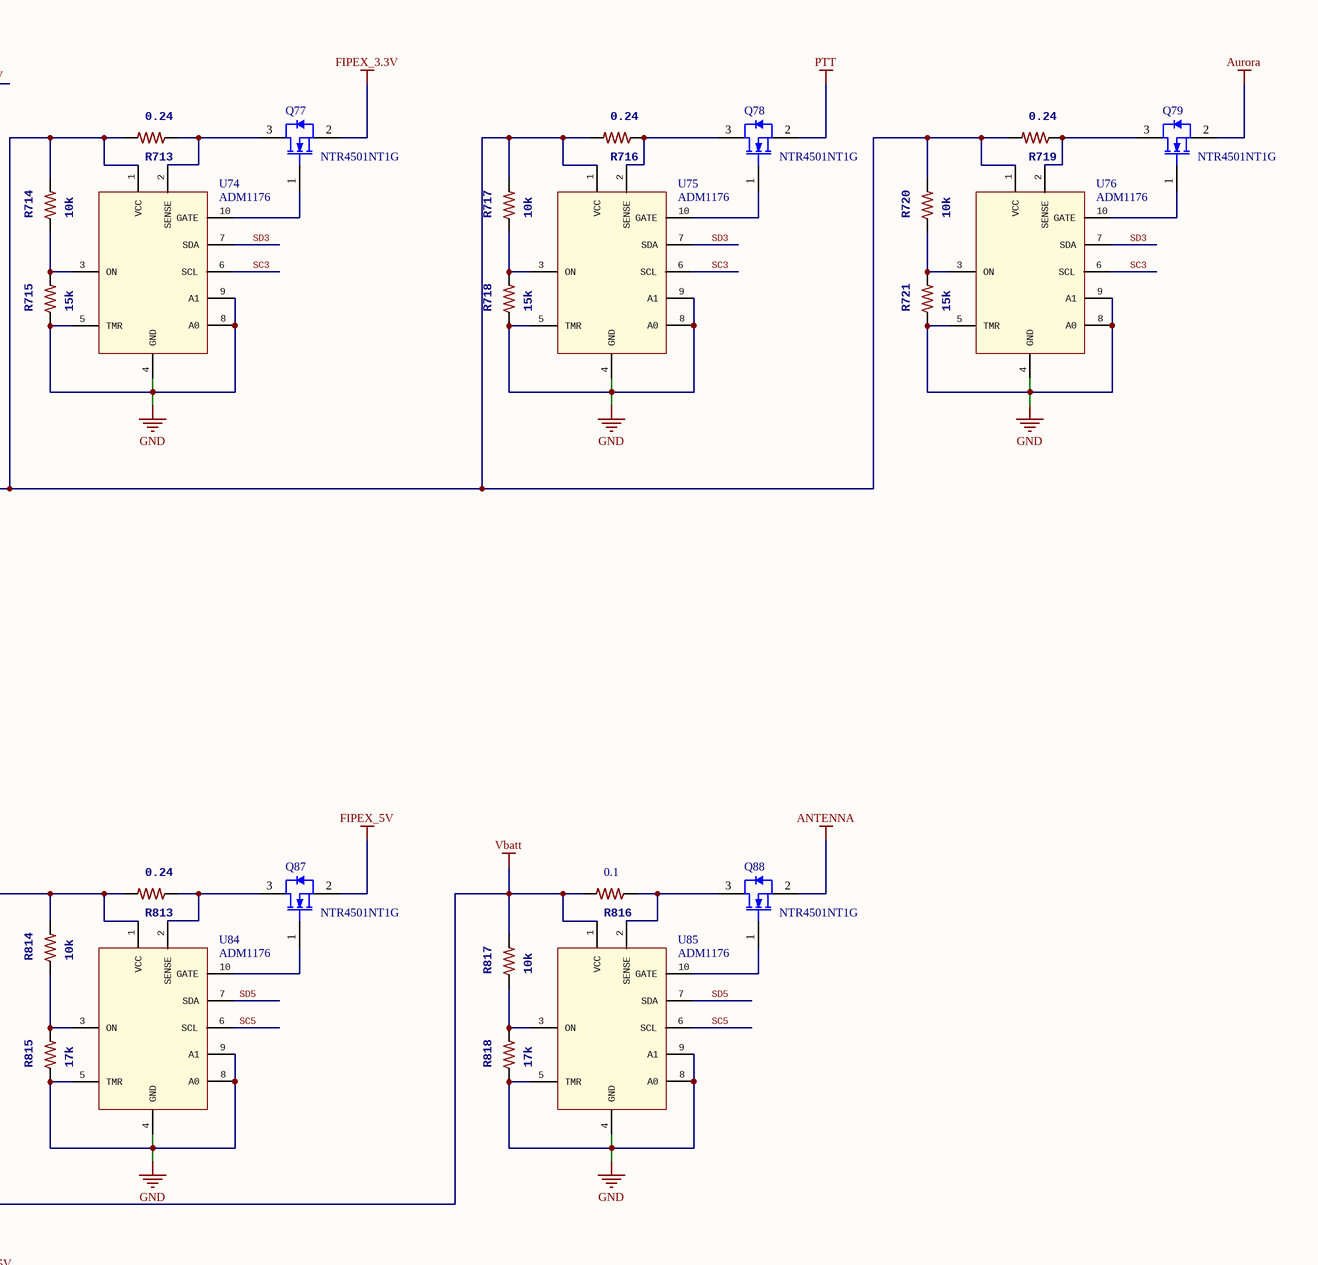
[diagram p4: BCR.SchDoc, right]

### Parts
C70  4.7 uF  [0805]
C72  1nF  [0402-CAP]
C73  270pF  [0402-CAP]
C74  1nF  [0402-CAP]
C75  22uF  [0805]
C76  4.7uF  [0805]
C77  0.22uF  [0805]
C78  0.22uF  [0805]
C79  100uF  [0805]
C82  1nF  [0402-CAP]
C83  270pF  [0402-CAP]
C84  1nF  [0402-CAP]
C85  22uF  [0805]
C86  4.7uF  [0805]
C87  0.22uF  [0805]
C88  0.22uF  [0805]
C89  100uF  [0805]
D72  NSVBAT54HT1G  [ONSC-SOD-323-2-477-02_V]
D73  NSVBAT54HT1G  [ONSC-SOD-323-2-477-02_V]
D82  NSVBAT54HT1G  [ONSC-SOD-323-2-477-02_V]
D83  NSVBAT54HT1G  [ONSC-SOD-323-2-477-02_V]
L72  4.7uH  [1007]
L82  3.3uH  [1007]
Q72  PMXB40UNEZ  [NXP-SOT1215_M]
Q73  PMXB40UNEZ  [NXP-SOT1215_M]
Q74  PMXB40UNEZ  [NXP-SOT1215_M]
Q75  PMXB40UNEZ  [NXP-SOT1215_M]
Q76  NTR4501NT1G  [ONSC-SOT-23-3-318-08_V]
Q77  NTR4501NT1G  [ONSC-SOT-23-3-318-08_V]
Q78  NTR4501NT1G  [ONSC-SOT-23-3-318-08_V]
Q79  NTR4501NT1G  [ONSC-SOT-23-3-318-08_V]
Q82  PMXB40UNEZ  [NXP-SOT1215_M]
Q83  PMXB40UNEZ  [NXP-SOT1215_M]
Q84  PMXB40UNEZ  [NXP-SOT1215_M]
Q85  PMXB40UNEZ  [NXP-SOT1215_M]
Q86  NTR4501NT1G  [ONSC-SOT-23-3-318-08_V]
Q87  NTR4501NT1G  [ONSC-SOT-23-3-318-08_V]
Q88  NTR4501NT1G  [ONSC-SOT-23-3-318-08_V]
R70  100K  [0805]
R71  21.5K  [0805]
R72  205k  [0603-RES]
R73  121k  [0603-RES]
R74  205k  [0603-RES]
R75  1.3k  [0603-RES]
R76  121k  [0603-RES]
R77  12k  [0603-RES]
R78  59k  [0603-RES]
R79  42.2k  [0603-RES]
R82  205k  [0603-RES]
R83  66.5k  [0603-RES]
R84  205k  [0603-RES]
R85  1.3k  [0603-RES]
R86  66.5k  [0603-RES]
R87  12k  [0603-RES]
R88  59k  [0603-RES]
R89  42.2k  [0603-RES]
R710  0.24  [RESC1220X06N]
R711  10k  [0603-RES]
R712  15k  [0603-RES]
R713  0.24  [RESC1220X06N]
R714  10k  [0603-RES]
R715  15k  [0603-RES]
R716  0.24  [RESC1220X06N]
R717  10k  [0603-RES]
R718  15k  [0603-RES]
R719  0.24  [RESC1220X06N]
R720  10k  [0603-RES]
R721  15k  [0603-RES]
R810  0.24  [RESC1220X06N]
R811  10k  [0603-RES]
R812  17k  [0603-RES]
R813  0.24  [RESC1220X06N]
R814  10k  [0603-RES]
R815  17k  [0603-RES]
R816  value 0.1  [0603-RES]  (hidden comment: 0603)
R817  10k  [0603-RES]
R818  17k  [0603-RES]
U70  LTC4415IDHC#PBF  [LT-DHC-16_A_V]
U72  LTC3785IUF#PBF  [LT-UF-24_M]
U73  ADM1176  [MSOP-10]
U74  ADM1176  [MSOP-10]
U75  ADM1176  [MSOP-10]
U76  ADM1176  [MSOP-10]
U82  LTC3785IUF#PBF  [LT-UF-24_M]
U83  ADM1176  [MSOP-10]
U84  ADM1176  [MSOP-10]
U85  ADM1176  [MSOP-10]

### Nets
3V3: C73.1 C79.1 Q74.3(D) Q74.4(D) R72.2 R74.2 R710.2 R711.2 R713.2 R714.2 R716.2 R717.2 R719.2 R720.2 U72.10(ISVOUT) U73.1(VCC) U74.1(VCC) U75.1(VCC) U76.1(VCC)
5V: C75.1 C83.1 C85.1 C89.1 Q72.3(D) Q72.4(D) Q82.3(D) Q82.4(D) Q84.3(D) Q84.4(D) R82.2 R84.2 R810.2 R811.2 R813.2 R814.2 R816.2 R817.2 U72.22(ISVIN) U72.24(VIN) U82.10(ISVOUT) U82.22(ISVIN) U82.24(VIN) U83.1(VCC) U84.1(VCC) U85.1(VCC)  [also labelled Vbatt]
ACS_5V: Q86.2(S)
ANTENNA: Q88.2(S)
Aurora: Q79.2(S)
FIPEX_3.3V: Q77.2(S)
FIPEX_5V: Q87.2(S)
GND: C70.2 C72.1 C75.2 C76.2 C79.2 C82.1 C85.2 C86.2 C89.2 Q73.2(S) Q75.2(S) Q83.2(S) Q85.2(S) R71.1 R73.1 R76.1 R78.1 R79.1 R83.1 R86.1 R88.1 R89.1 R712.1 R715.1 R718.1 R721.1 R812.1 R815.1 R818.1 U70.17(EP) U72.6(CCM) U72.8(MODE) U72.25(EP) U73.4(GND) U73.5(TMR) U73.8(A0) U73.9(A1) U74.4(GND) U74.5(TMR) U74.8(A0) U74.9(A1) U75.4(GND) U75.5(TMR) U75.8(A0) U75.9(A1) U76.4(GND) U76.5(TMR) U76.8(A0) U76.9(A1) U82.6(CCM) U82.8(MODE) U82.25(EP) U83.4(GND) U83.5(TMR) U83.8(A0) U83.9(A1) U84.4(GND) U84.5(TMR) U84.8(A0) U84.9(A1) U85.4(GND) U85.5(TMR) U85.8(A0) U85.9(A1)  [project net ARRAYNX.3.NEG.NEG]
PTT: Q78.2(S)
5V USB: R70.2 U70.1(IN1) U70.2(IN1)
ACS3.3V: Q76.2(S)
SC3: U74.6(SCL) U75.6(SCL) U76.6(SCL)
SC5: U83.6(SCL) U84.6(SCL) U85.6(SCL)
SD3: U73.7(SDA) U74.7(SDA) U75.7(SDA) U76.7(SDA)
SD5: U84.7(SDA) U85.7(SDA)
Vchrg: U70.7(IN2) U70.8(IN2)
Vin: C70.1 U70.9(OUT2) U70.10(OUT2) U70.15(OUT1) U70.16(OUT1)  [project net ARRAYNZ.8.SDA.NC]
NetC72_2: C72.2 U72.1(RUN/SS)
NetC73_2: C73.2 R75.2
NetC74_1: C74.1 R77.2
NetC74_2: C74.2 U72.2(VC)
NetC76_1: C76.1 D72.2(A) D73.2(A) U72.16(VDRV) U72.23(VCC)
NetC77_1: C77.1 D72.1(K) U72.21(VBST1)
NetC77_2: C77.2 L72.1 Q72.2(S) Q73.3(D) Q73.4(D) U72.18(ISSW1) U72.19(SW1)
NetC78_1: C78.1 D73.1(K) U72.11(VBST2)
NetC78_2: C78.2 L72.2 Q74.2(S) Q75.3(D) Q75.4(D) U72.13(SW2) U72.14(ISSW2)
NetC82_2: C82.2 U82.1(RUN/SS)
NetC83_2: C83.2 R85.2
NetC84_1: C84.1 R87.2
NetC84_2: C84.2 U82.2(VC)
NetC86_1: C86.1 D82.2(A) D83.2(A) U82.16(VDRV) U82.23(VCC)
NetC87_1: C87.1 D82.1(K) U82.21(VBST1)
NetC87_2: C87.2 L82.1 Q82.2(S) Q83.3(D) Q83.4(D) U82.18(ISSW1) U82.19(SW1)
NetC88_1: C88.1 D83.1(K) U82.11(VBST2)
NetC88_2: C88.2 L82.2 Q84.2(S) Q85.3(D) Q85.4(D) U82.13(SW2) U82.14(ISSW2)
NetQ72_1: Q72.1(G) U72.20(TG1)
NetQ73_1: Q73.1(G) U72.17(BG1)
NetQ74_1: Q74.1(G) U72.12(TG2)
NetQ75_1: Q75.1(G) U72.15(BG2)
NetQ76_1: Q76.1(G) U73.10(GATE)
NetQ76_3: Q76.3(D) R710.1 U73.2(SENSE)
NetQ77_1: Q77.1(G) U74.10(GATE)
NetQ77_3: Q77.3(D) R713.1 U74.2(SENSE)
NetQ78_1: Q78.1(G) U75.10(GATE)
NetQ78_3: Q78.3(D) R716.1 U75.2(SENSE)
NetQ79_1: Q79.1(G) U76.10(GATE)
NetQ79_3: Q79.3(D) R719.1 U76.2(SENSE)
NetQ82_1: Q82.1(G) U82.20(TG1)
NetQ83_1: Q83.1(G) U82.17(BG1)
NetQ84_1: Q84.1(G) U82.12(TG2)
NetQ85_1: Q85.1(G) U82.15(BG2)
NetQ86_1: Q86.1(G) U83.10(GATE)
NetQ86_3: Q86.3(D) R810.1 U83.2(SENSE)
NetQ87_1: Q87.1(G) U84.10(GATE)
NetQ87_3: Q87.3(D) R813.1 U84.2(SENSE)
NetQ88_1: Q88.1(G) U85.10(GATE)
NetQ88_3: Q88.3(D) R816.1 U85.2(SENSE)
NetR70_1: R70.1 R71.2 U70.6(~{EN2})
NetR72_1: R72.1 R73.2 U72.4(VSENSE)
NetR74_1: R74.1 R75.1 R76.2 R77.1 U72.3(FB)
NetR78_2: R78.2 U72.7(RT)
NetR79_2: R79.2 U72.5(ILSET)
NetR82_1: R82.1 R83.2 U82.4(VSENSE)
NetR84_1: R84.1 R85.1 R86.2 R87.1 U82.3(FB)
NetR88_2: R88.2 U82.7(RT)
NetR89_2: R89.2 U82.5(ILSET)
NetR711_1: R711.1 R712.2 U73.3(ON)
NetR714_1: R714.1 R715.2 U74.3(ON)
NetR717_1: R717.1 R718.2 U75.3(ON)
NetR720_1: R720.1 R721.2 U76.3(ON)
NetR811_1: R811.1 R812.2 U83.3(ON)
NetR814_1: R814.1 R815.2 U84.3(ON)
NetR817_1: R817.1 R818.2 U85.3(ON)

Not connected (* = marked no-connect by the designer): U70 3(EN1)* 4(CLIM1)* 5(CLIM2)* 11(~{STAT2}) 12(~{WARN2}) 13(~{WARN1}) 14(~{STAT1}); U72 9(NC); U73 6(SCL); U82 9(NC); U83 7(SDA)

### Notes on the sheet
- Labels drawn without touching a wire or pin: 5V, SC3, SD5
- (in symbol CMP-1258-00046-1) 3, 4

### Library data of the parts
C70 = CAP0805_4700nF: as C17 on sheet MPPT-BCR; RoHS: RoHS Compliant; Category: Capacitors; Packaging: Tape & Reel (TR); Mounting Type: Surface Mount, MLCC; Operating Temperature: -55°C ~ 125°C; Applications: General Purpose; Ratings: -; Package / Case: 0805 (2012 Metric); Size / Dimension: 0.079" L x 0.049" W (2.00mm x 1.25mm); Thickness (Max): 0.039" (1.00mm); Value: 4.7 uF; Supplier 1: Digi-Key; Supplier Part Number 1: 709-1230-1-ND
C72-C74 C82-C84 = CAP0402-CAP: Supplier 1: Digi-Key
  C72 C74 C82 C84: Supplier Part Number 1: 490-1303-1-ND
  C73 C83: Supplier Part Number 1: 1276-1673-1-ND
C75-C79 C85-C89 = CAP0805: Manufacturer: Kemet; Manufacturer Part Number: C0805C105K8RACTU; Tolerance: ±10%; Voltage - Rated: 10V; Temperature Coefficient: X7R; RoHS: RoHS Compliant; Category: Capacitors; Packaging: Tape & Reel (TR); Mounting Type: Surface Mount, MLCC; Operating Temperature: -55°C ~ 125°C; Applications: General Purpose; Ratings: -; Package / Case: 0805 (2012 Metric); Size / Dimension: 0.079" L x 0.049" W (2.00mm x 1.25mm); Height - Seated (Max): -; Thickness (Max): 0.039" (1.00mm); Lead Spacing: -; Features: -; Lead Style: -; ComponentLink1URL: http://www.kemet.com/docfinder?Partnumber=C0805C105K8RACTU; ComponentLink1Description: http://www.kemet.com/docfinder?Partnumber=C0805C105K8RACTU; Supplier 1: Digi-Key
  C75 C85: Supplier Part Number 1: 490-1719-1-ND
  C76 C86: Supplier Part Number 1: 490-3338-1-ND
  C77 C78 C87 C88: Supplier Part Number 1: 490-1670-1-ND
  C79 C89: Supplier Part Number 1: 490-10510-1-ND
D72 D73 D82 D83 = CMP-1055-00464-1: Schottky Barrier Diode, 2-Pin SOD-323, Pb-Free, Tape and Reel; Manufacturer: On Semiconductor; Configuration: Single; IFSM Max (A): 0.6; trr Max (ns): 5; ComponentLink1URL: http://www.onsemi.com/; ComponentLink2URL: http://www.onsemi.cn/pub_link/Collateral/BAT54HT1-D.PDF; ComponentLink2Description: Datasheet; PackageReference: SOD-323-2-477-02; ComponentLink3URL: http://www.onsemi.com/pub_link/Collateral/477-02.PDF.1; Mounting Technology: Surface Mount; DatasheetVersion: Rev. 6; PartNumber: NSVBAT54HT1G; ComponentLink3Description: Package Specification; PackageDescription: 2-Pin SOD, Body 1.7 x 1.25 mm; RoHS: TRUE; PackageVersion: Rev. H, 03/2007; Packing: Tape and Reel; ComponentLink1Description: Manufacturer URL
L72 L82 = INDUCTOR1007: Supplier 1: Digi-Key
  L72: Supplier Part Number 1: 587-1621-1-ND
  L82: Supplier Part Number 1: 587-2186-1-ND
Q72-Q75 Q82-Q85 = CMP-1258-00046-1: N-Channel Trench MOSFET, 12 V, 3.2 A, -55 to 150 degC, 4-Pin SOT1215; Manufacturer: NXP Semiconductors; VDS [max] (V): 12; Coss [typ] (pF): 107; Ciss [typ] (pF): 556; Channel Type: N; VGSth [typ] (V): 0.65; ID [max] (A): 3.2; ComponentLink1URL: http://www.nxp.com/; PackageVersion: 13-03-06, 03/2013; ComponentLink2URL: http://www.nxp.com/documents/data_sheet/PMXB40UNE.pdf; PartNumber: PMXB40UNEZ; PackageReference: SOT1215; Mounting Technology: Surface Mount; ComponentLink2Description: Datasheet; ComponentLink3URL: http://www.nxp.com/documents/outline_drawing/sot1215_po.pdf; ComponentLink3Description: Package Specification; PackageDescription: 3-Pin Small Outline No-Lead, Body 1.1 x 1 mm, Pitch 0.75 mm; ComponentLink1Description: Manufacturer URL; DatasheetVersion: Rev. 1
Q76-Q79 Q86-Q88 = CMP-1058-00732-1: Power MOSFET, 20 V, 3.2 A, Single N-Channel, 3-Pin SOT-23, Pb-Free, Tape and Reel; Manufacturer: On Semiconductor; VGS Max (V): 12; VGS(th) Max (V): 1.2; PD Max (W): 1.25; Coss Typ (pF): 80; Ciss Typ (pF): 200; V(BR)DSS Min (V): 20; Qrr Typ (nC): 3; Crss Typ (pF): 50; Channel Polarity: N Channel; RoHS: Pb-Free; ComponentLink3URL: http://www.onsemi.cn/pub_link/Collateral/318-08.PDF; ComponentLink2Description: Datasheet; PackageVersion: Rev. AP, 11/2009; Mounting Technology: Surface Mount; PackageDescription: 3-Pin Small Outline Transistor, Body 2.92 x 1.3 mm, Pitch 0.95 mm; PackageReference: SOT-23-3-318-08; ComponentLink1URL: http://www.onsemi.com/; Packing: Tape and Reel; Configuration: Single; ComponentLink2URL: http://www.onsemi.cn/pub_link/Collateral/NTR4501N-D.PDF; ComponentLink3Description: Package Specification; Package Type: SOT-23-3; ComponentLink1Description: Manufacturer URL; PartNumber: NTR4501NT1G; DatasheetVersion: Rev. 13
R70 = RES_0805_100K: Manufacturer: TE Connectivity; Manufacturer Part Number: 1625856-2; Resistance (Ohms): 10K; Tolerance: ±10%; Power (Watts): 0.125W, 1/8W; Temperature Coefficient: ±100ppm/°C; RoHS: RoHS Compliant; Category: Resistors; Packaging: Cut Tape (CT); Composition: Thick Film; Features: -; Operating Temperature: -55°C ~ 125°C; Package / Case: 0805 (2012 Metric); Supplier Device Package: 0805; Size / Dimension: 0.079" L x 0.047" W (2.00mm x 1.20mm); Height: 0.020" (0.50mm); Number of Terminations: 2; ComponentLink1URL: http://www.te.com/commerce/DocumentDelivery/DDEController?Action=srchrtrv&DocNm=1625856&DocType=Customer+Drawing&DocLang=English; ComponentLink1Description: http://www.te.com/commerce/DocumentDelivery/DDEController?Action=srchrtrv&DocNm=1625856&DocType=Customer+Drawing&DocLang=English; Value: 100K; Supplier 1: Digi-Key; Supplier Part Number 1: 311-100KCRCT-ND
R71 = RES_0805_21_5K: Manufacturer: TE Connectivity; Manufacturer Part Number: 1625856-2; Resistance (Ohms): 15K; Tolerance: ±10%; Power (Watts): 0.125W, 1/8W; Temperature Coefficient: ±100ppm/°C; RoHS: RoHS Compliant; Category: Resistors; Packaging: Cut Tape (CT); Composition: Thick Film; Features: -; Operating Temperature: -55°C ~ 125°C; Package / Case: 0805 (2012 Metric); Supplier Device Package: 0805; Size / Dimension: 0.079" L x 0.047" W (2.00mm x 1.20mm); Height: 0.020" (0.50mm); Number of Terminations: 2; ComponentLink1URL: http://www.te.com/commerce/DocumentDelivery/DDEController?Action=srchrtrv&DocNm=1625856&DocType=Customer+Drawing&DocLang=English; ComponentLink1Description: http://www.te.com/commerce/DocumentDelivery/DDEController?Action=srchrtrv&DocNm=1625856&DocType=Customer+Drawing&DocLang=English; Value: 21.5K; Supplier 1: Digi-Key; Supplier Part Number 1: 541-21.5KCCT-ND
R72-R79 R82-R89 R710-R721 R810-R815 R817 R818 = RESISTOR0603-RES: Supplier 1: Digi-Key
  R72 R74: Supplier Part Number 1: P205KHTR-ND
  R73 R76: Supplier Part Number 1: P121KHTR-ND
  R75 R85: Supplier Part Number 1: P1.30KHTR-ND
  R77: Supplier Part Number 1: P12.0KHTR-ND
  R78: Supplier Part Number 1: P59.0KHTR-ND
  R79 R89: Supplier Part Number 1: P42.2KHTR-ND
  R82: Supplier Part Number 1: P205KHCT-ND
  R83: Supplier Part Number 1: P66.5KHTR-ND
  R84: Supplier Part Number 1: P205KHDKR-ND
  R86: Supplier Part Number 1: P66.5KHCT-ND
  R87: Supplier Part Number 1: P12.0KHCT-ND
  R88: Supplier Part Number 1: P59.0KHCT-ND
  R710 R713 R716 R719 R810 R813: Supplier Part Number 1: P16011TR-ND
  R711 R714 R717 R720 R811 R814 R817: Supplier Part Number 1: P10.0KHTR-ND
  R712 R715 R718 R721: Supplier Part Number 1: P15.0KHTR-ND
  R812 R818: Supplier Part Number 1: P16.9KHCT-ND
  R815: Supplier Part Number 1: P16.9KHTR-ND
R816 = RESISTOR0603-RES: =Value; Supplier 1: Digi-Key; Supplier Part Number 1: 311-.10QCT-ND
U70 = CMP-0479-00074-1: Dual 4 A Ideal Diode with Adjustable Current Limit, Imon Output, Overcurrent Warning, Thermal Warning, 1.7 to 5.5 V Vin, 16-pin DFN (DHC-16_A), -40 to 125 degC, Pb-Free; Manufacturer: Linear Technology; Ideal Diode: Dual, Internal, P-Channel; Code_JEDEC: MO-229; ComponentLink3URL: http://cds.linear.com/docs/en/datasheet/4415fa.pdf; ComponentLink2URL: http://cds.linear.com/docs/en/datasheet/4415fa.pdf; Mounting Technology: Surface Mount; PackageDescription: 16-Pin Plastic DFN, Body 5 x 3 mm, Pitch 0.5 mm; ComponentLink1Description: Manufacturer URL; ComponentLink1URL: http://www.linear.com/; PackageVersion: Rev. Ø; PartNumber: LTC4415IDHC#PBF; PackageReference: DHC-16; ComponentLink3Description: Package Specification; DatasheetVersion: Rev. Ø; ComponentLink2Description: Datasheet; RoHS: TRUE
U72 U82 = CMP-0492-02264-1: High Efficiency, Synchronous, No Rsense Buck-Boost Controller, 24-pin QFN (UF24), -40 to 125 degC, Pb-Free; Manufacturer: Linear Technology; Number of Outputs: 1; Code_JEDEC: MO-220; PartNumber: LTC3785IUF#PBF; ComponentLink1Description: Manufacturer URL; PackageReference: UF24; ComponentLink3Description: Package Specification; PackageDescription: 24-Pin Plastic QFN, Body 4 x 4 mm, Pitch 0.5 mm; PackageVersion: Rev. B, 02/2012; ComponentLink1URL: http://www.linear.com/; ComponentLink3URL: http://cds.linear.com/docs/en/packaging/%28UF24%29%20QFN%2005-08-1697%20Rev%20B.pdf; ComponentLink2Description: Datasheet; DatasheetVersion: Rev. C; ComponentLink2URL: http://cds.linear.com/docs/en/datasheet/3785fc.pdf; RoHS: TRUE; Mounting Technology: Surface Mount
U73-U76 U83-U85 = ADM1176: DataSheet: http://www.analog.com/static/imported-files/data_sheets/ADM1176.pdf; MPN: ADM1176; Supplier 1: Digi-Key; Supplier Part Number 1: ADM1176-1ARMZ-R7CT-ND